# EAGLE schematic Revolve_A1 (EAGLE 7.7.0)
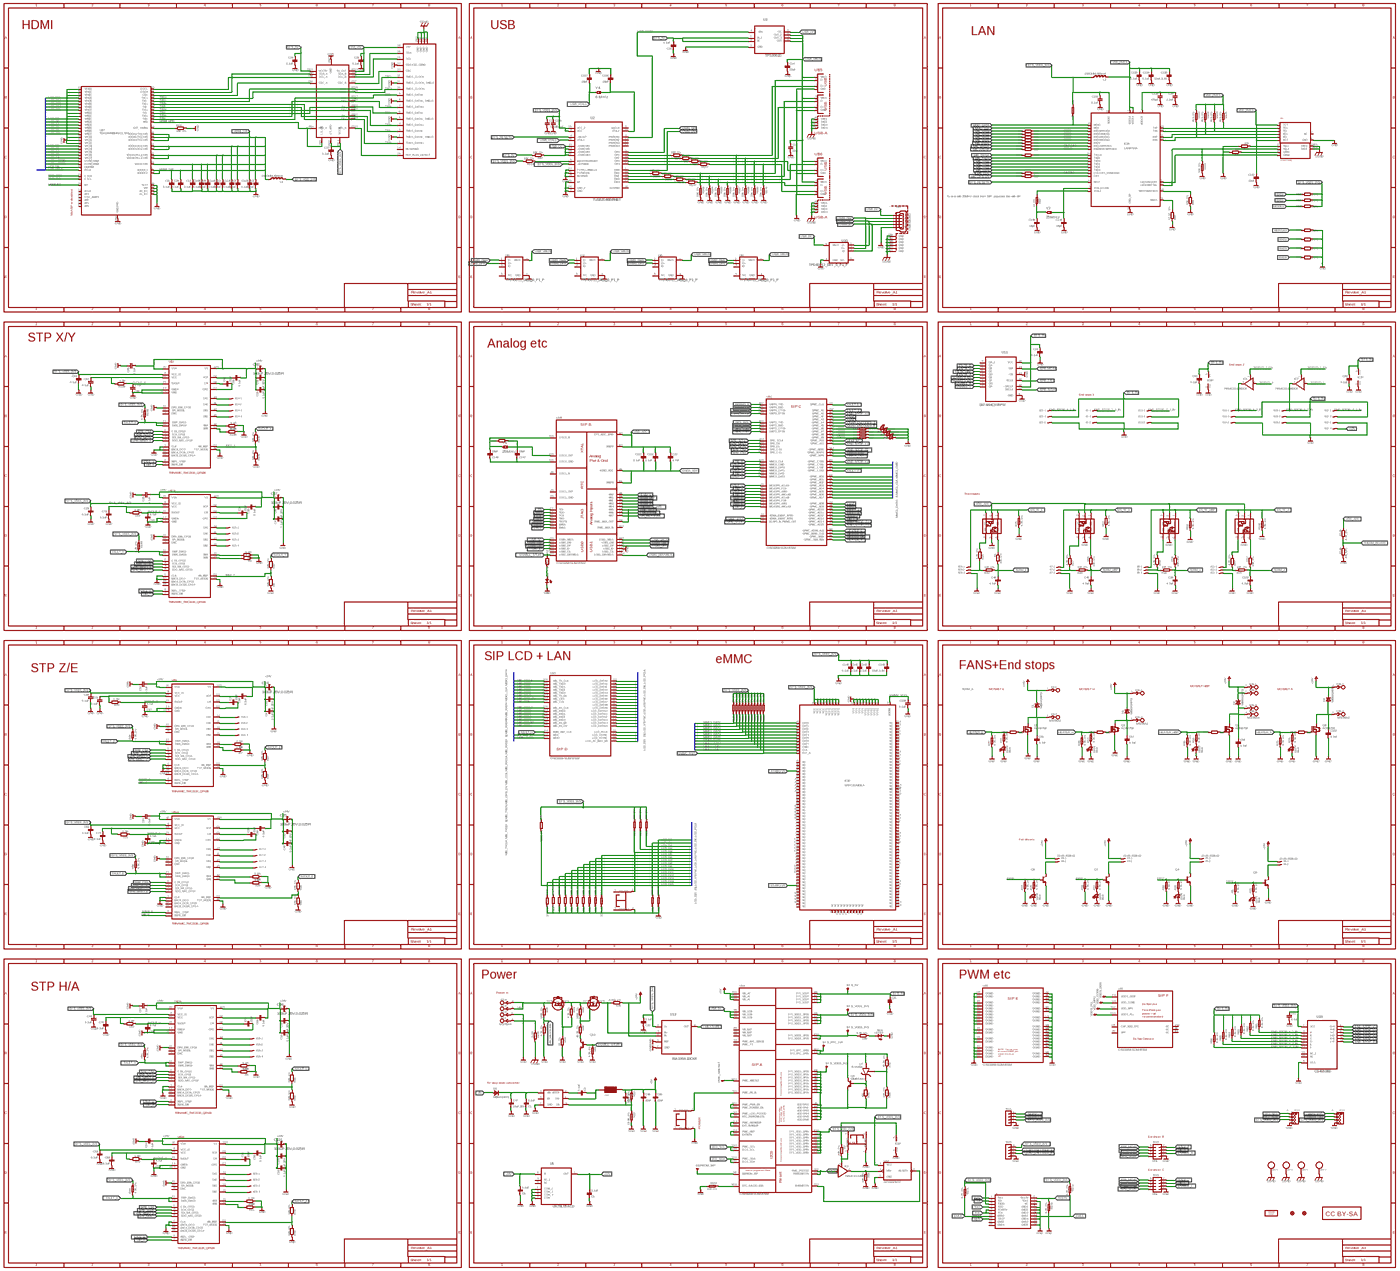
[diagram p0: schematic, sheet 1, overview]
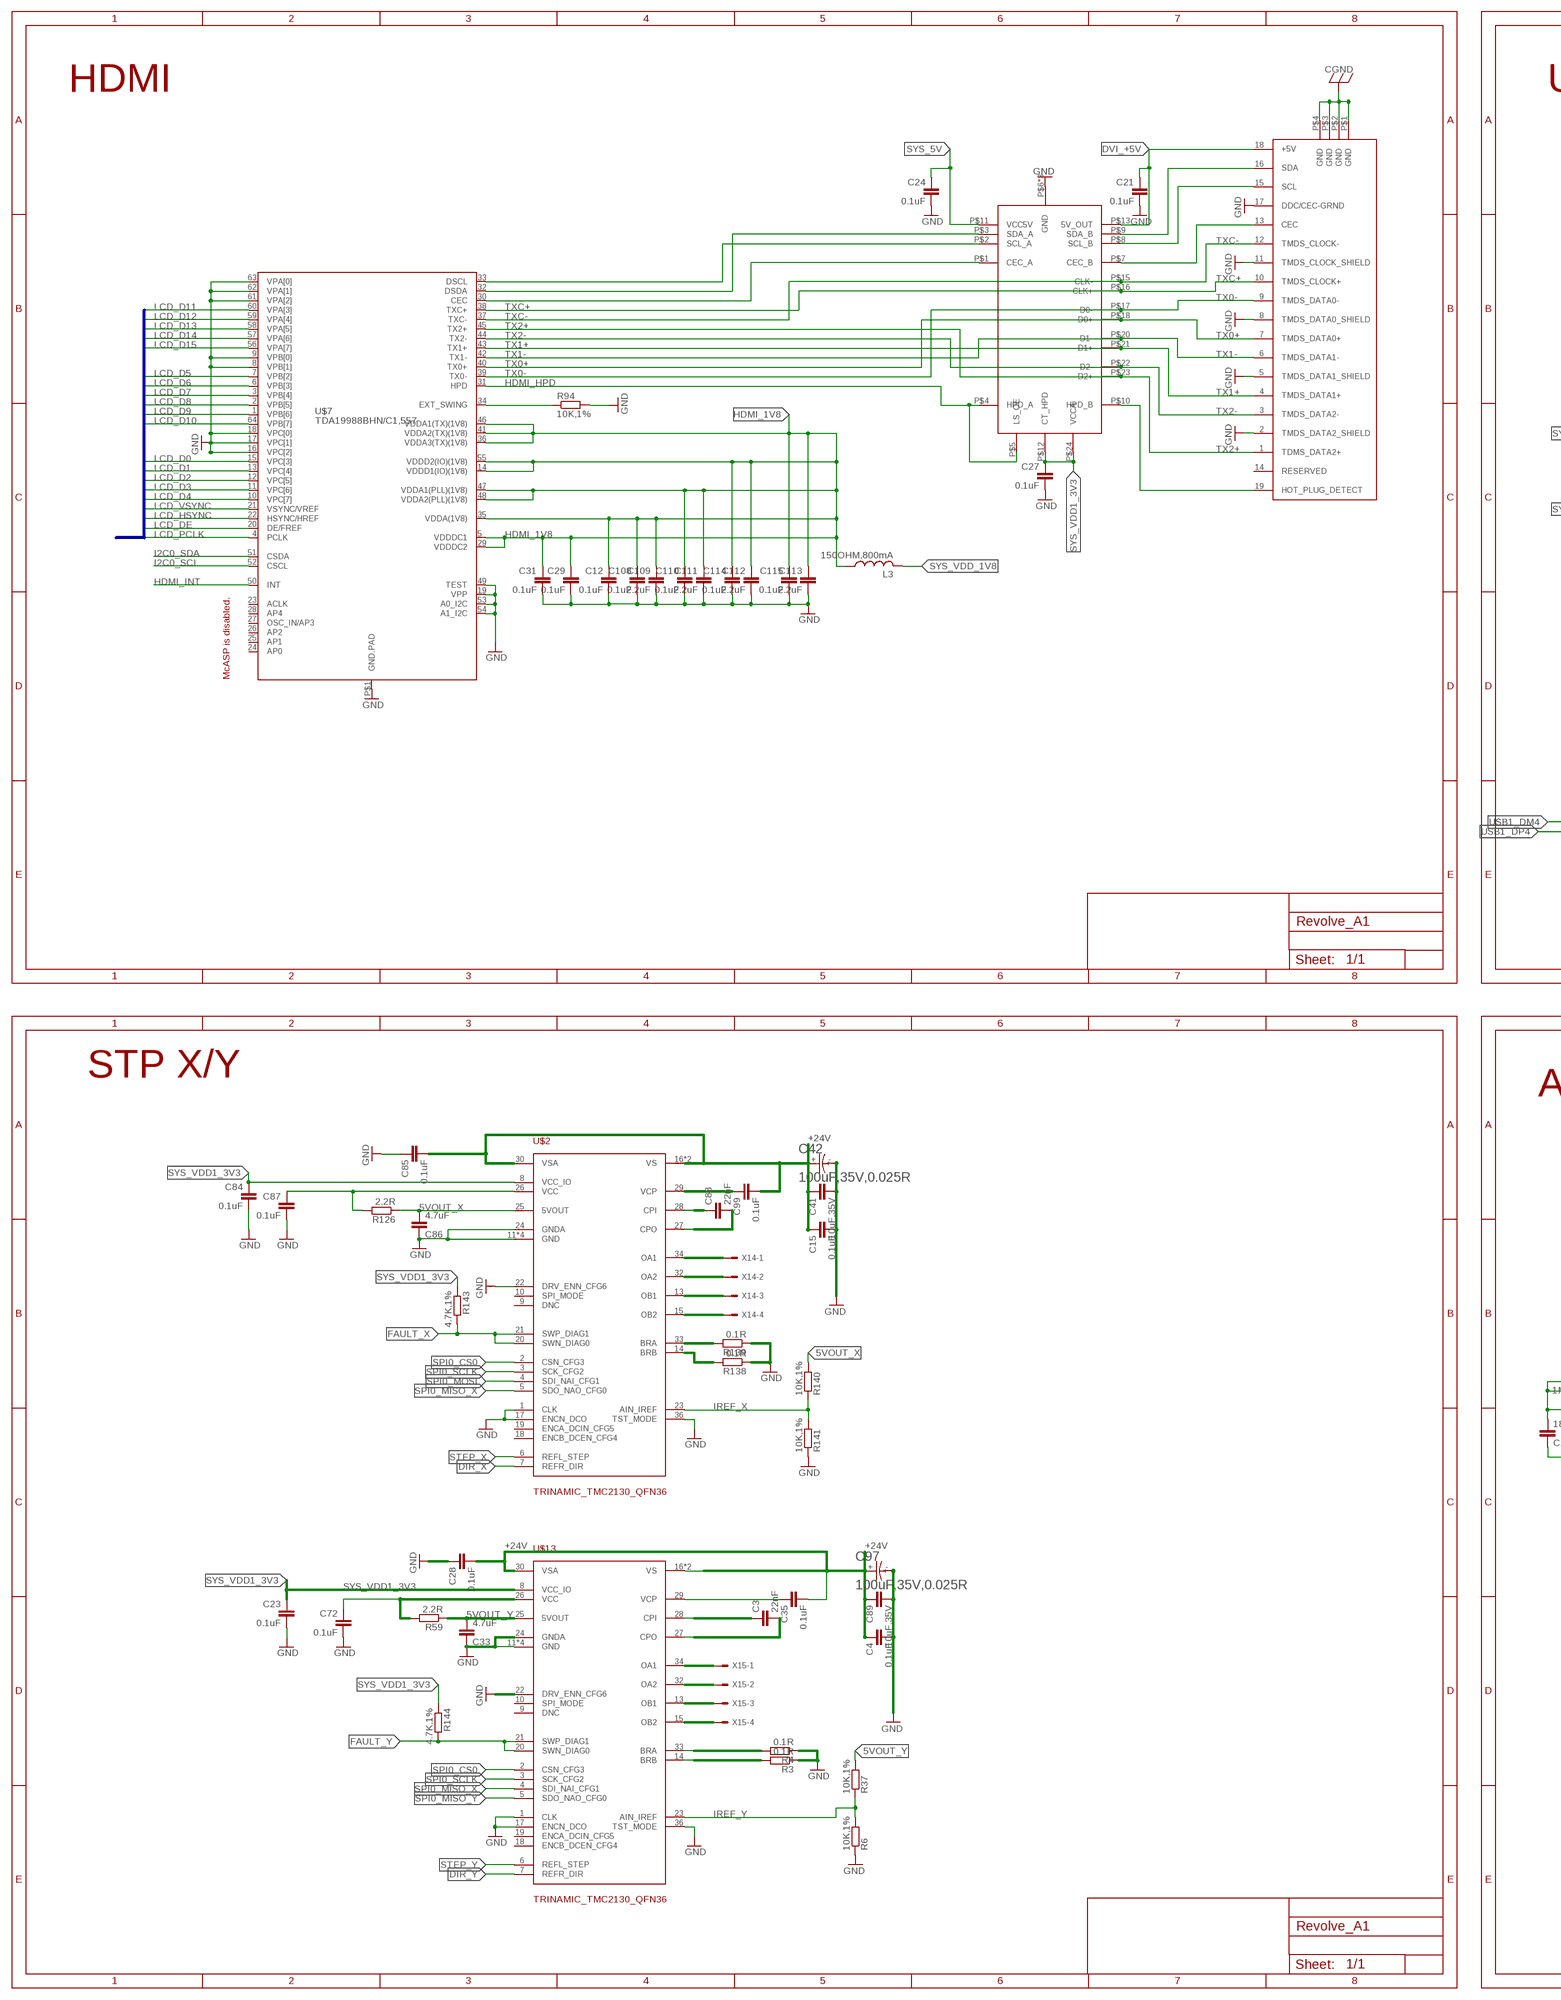
[diagram p1: schematic, sheet 1, part 1 of 6]
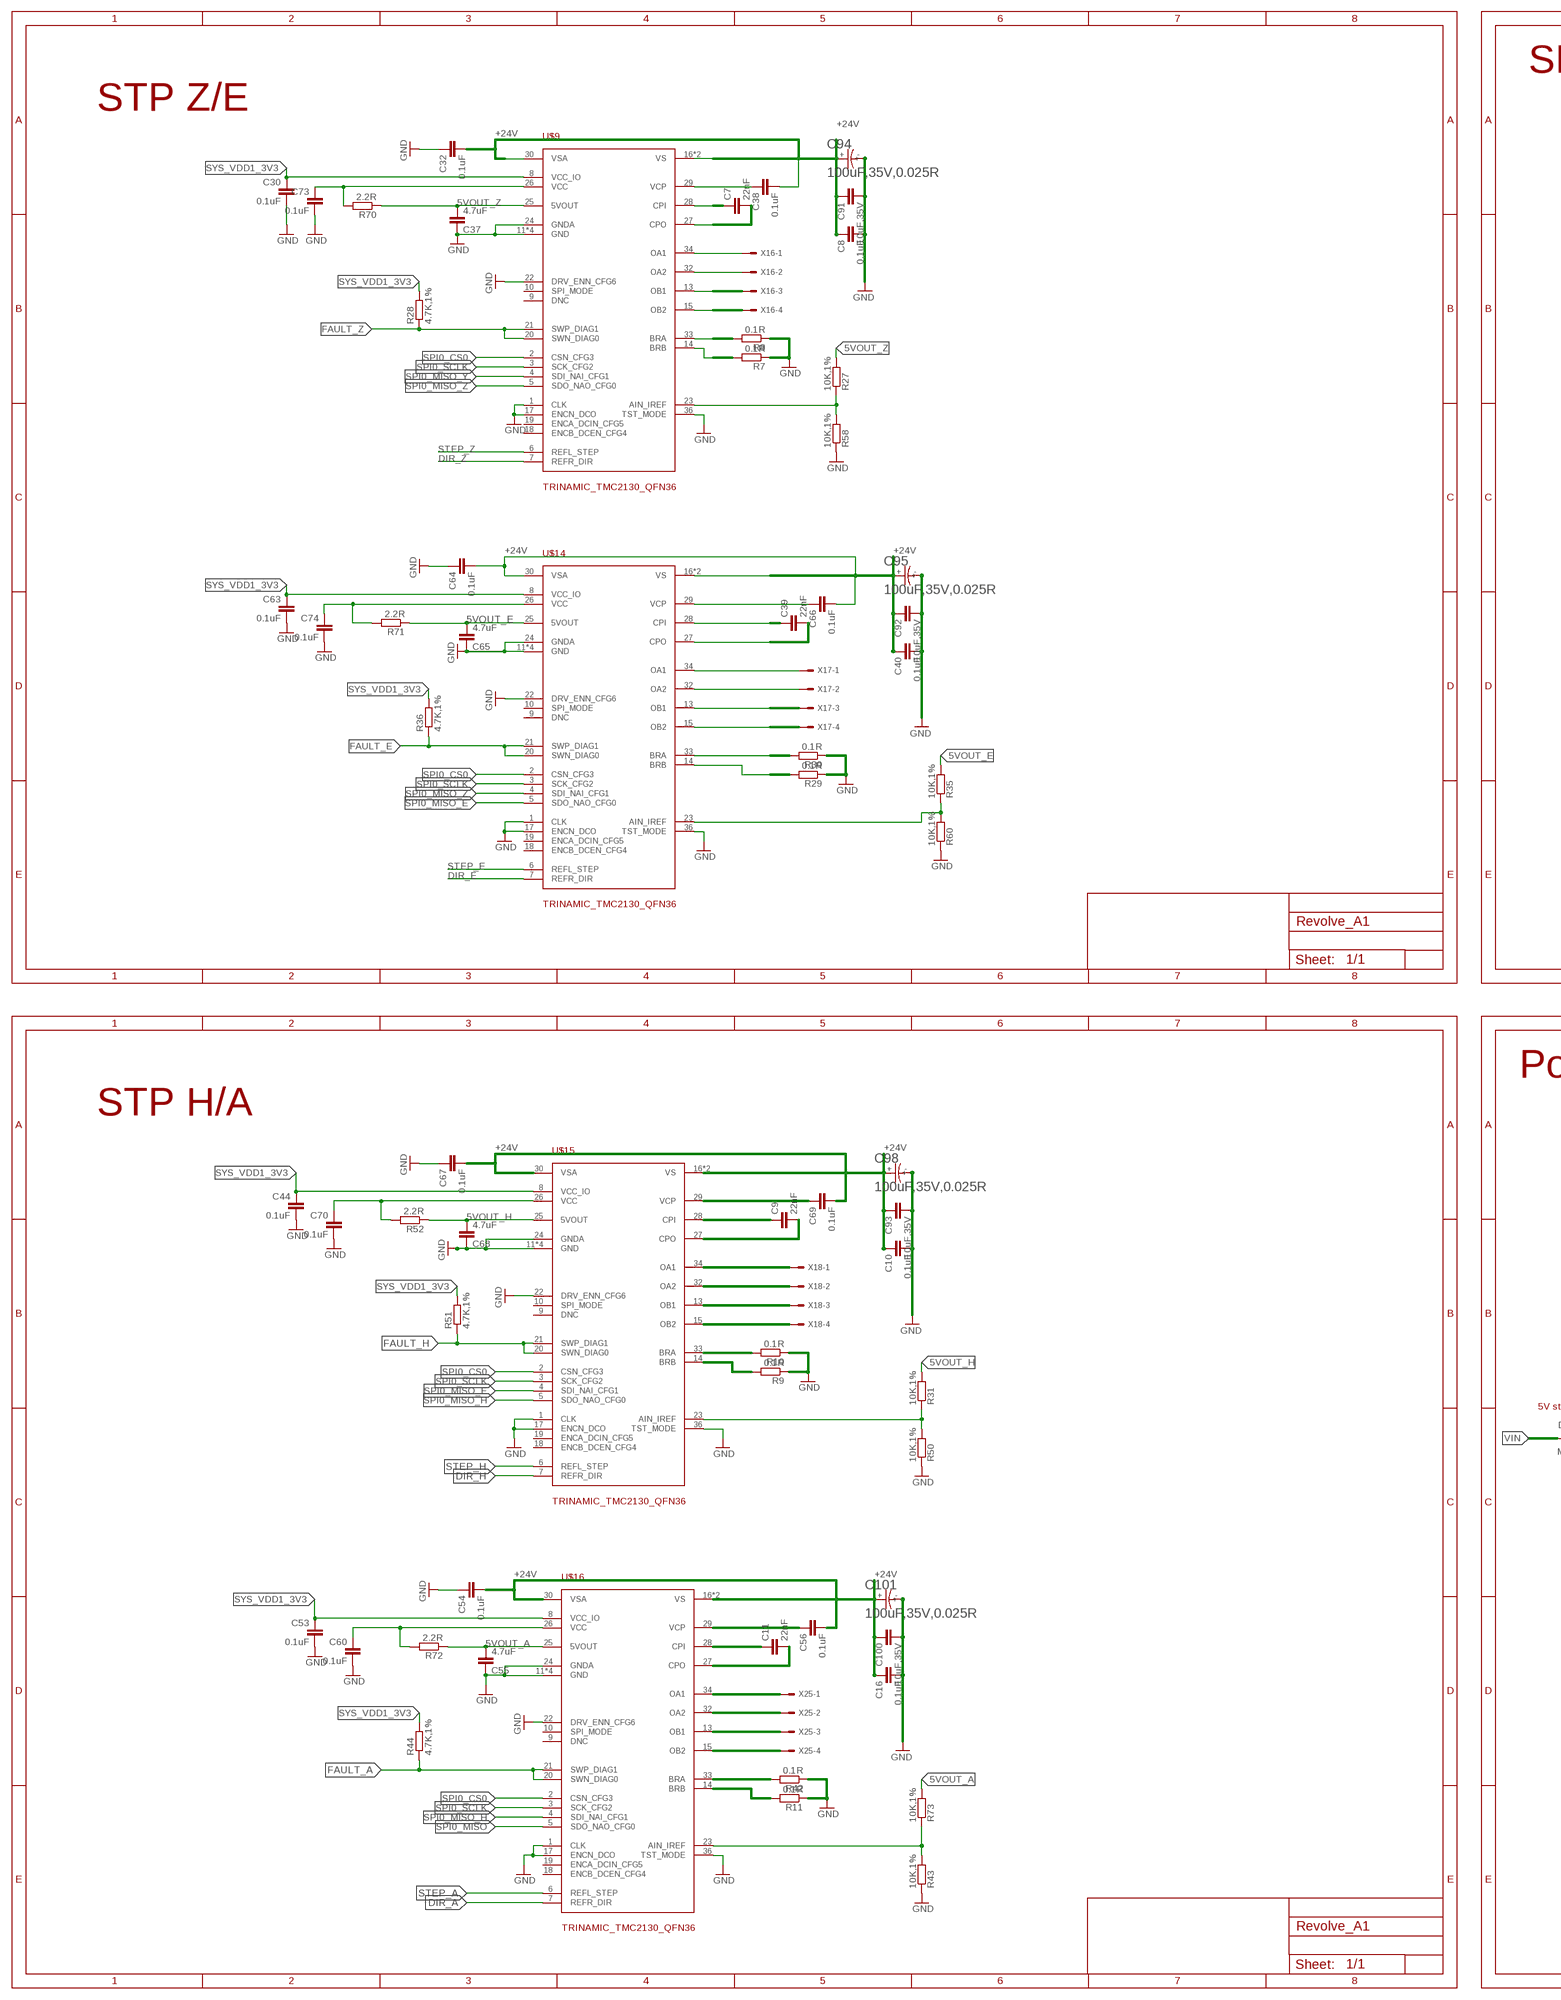
[diagram p2: schematic, sheet 1, part 2 of 6]
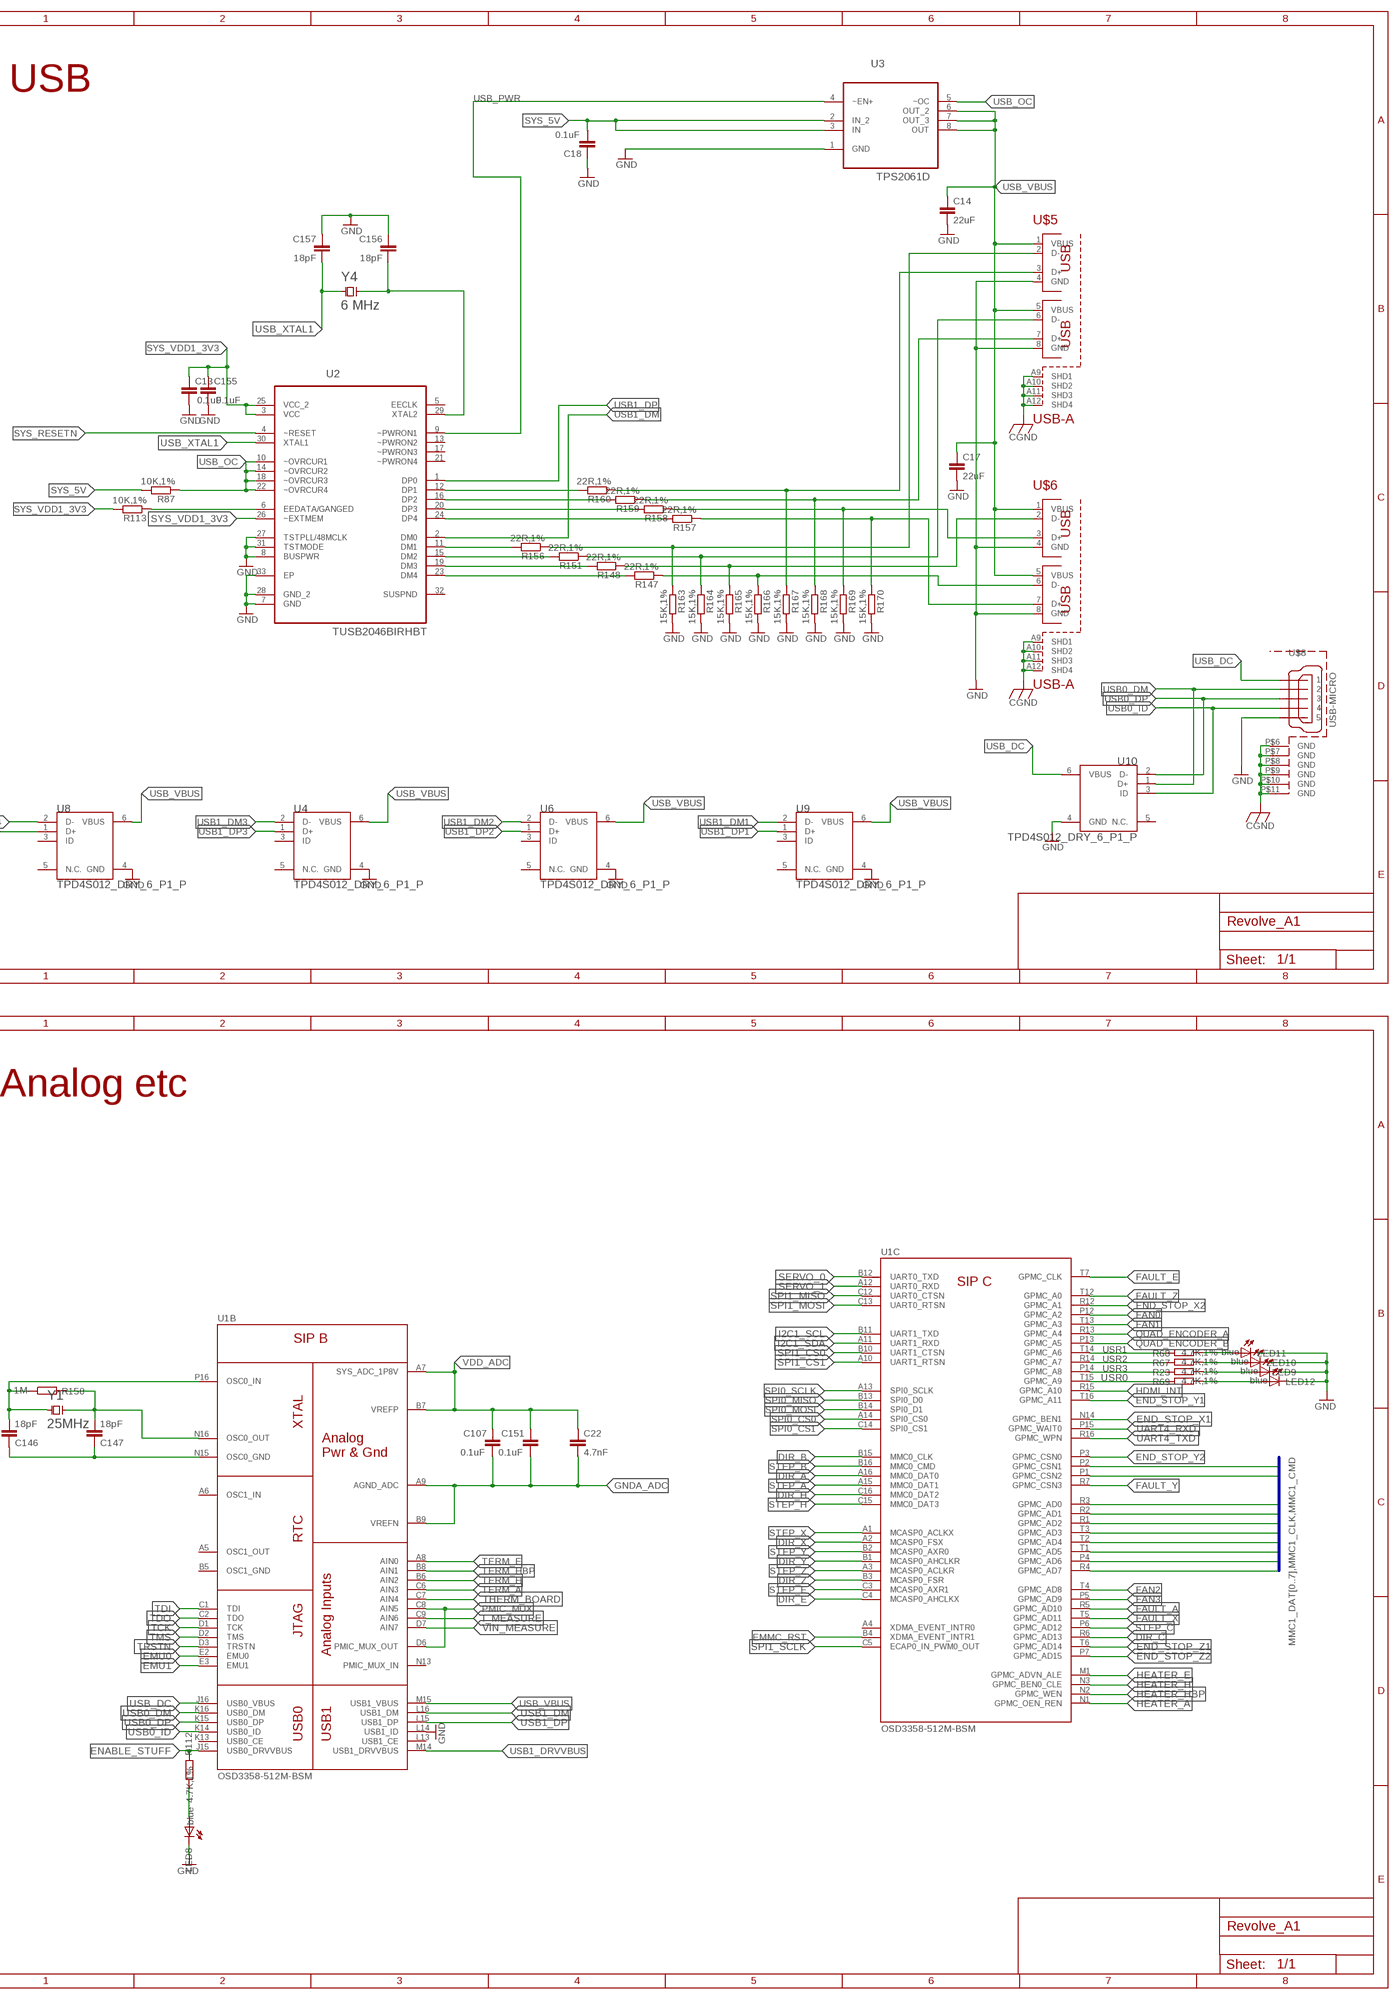
[diagram p3: schematic, sheet 1, part 3 of 6]
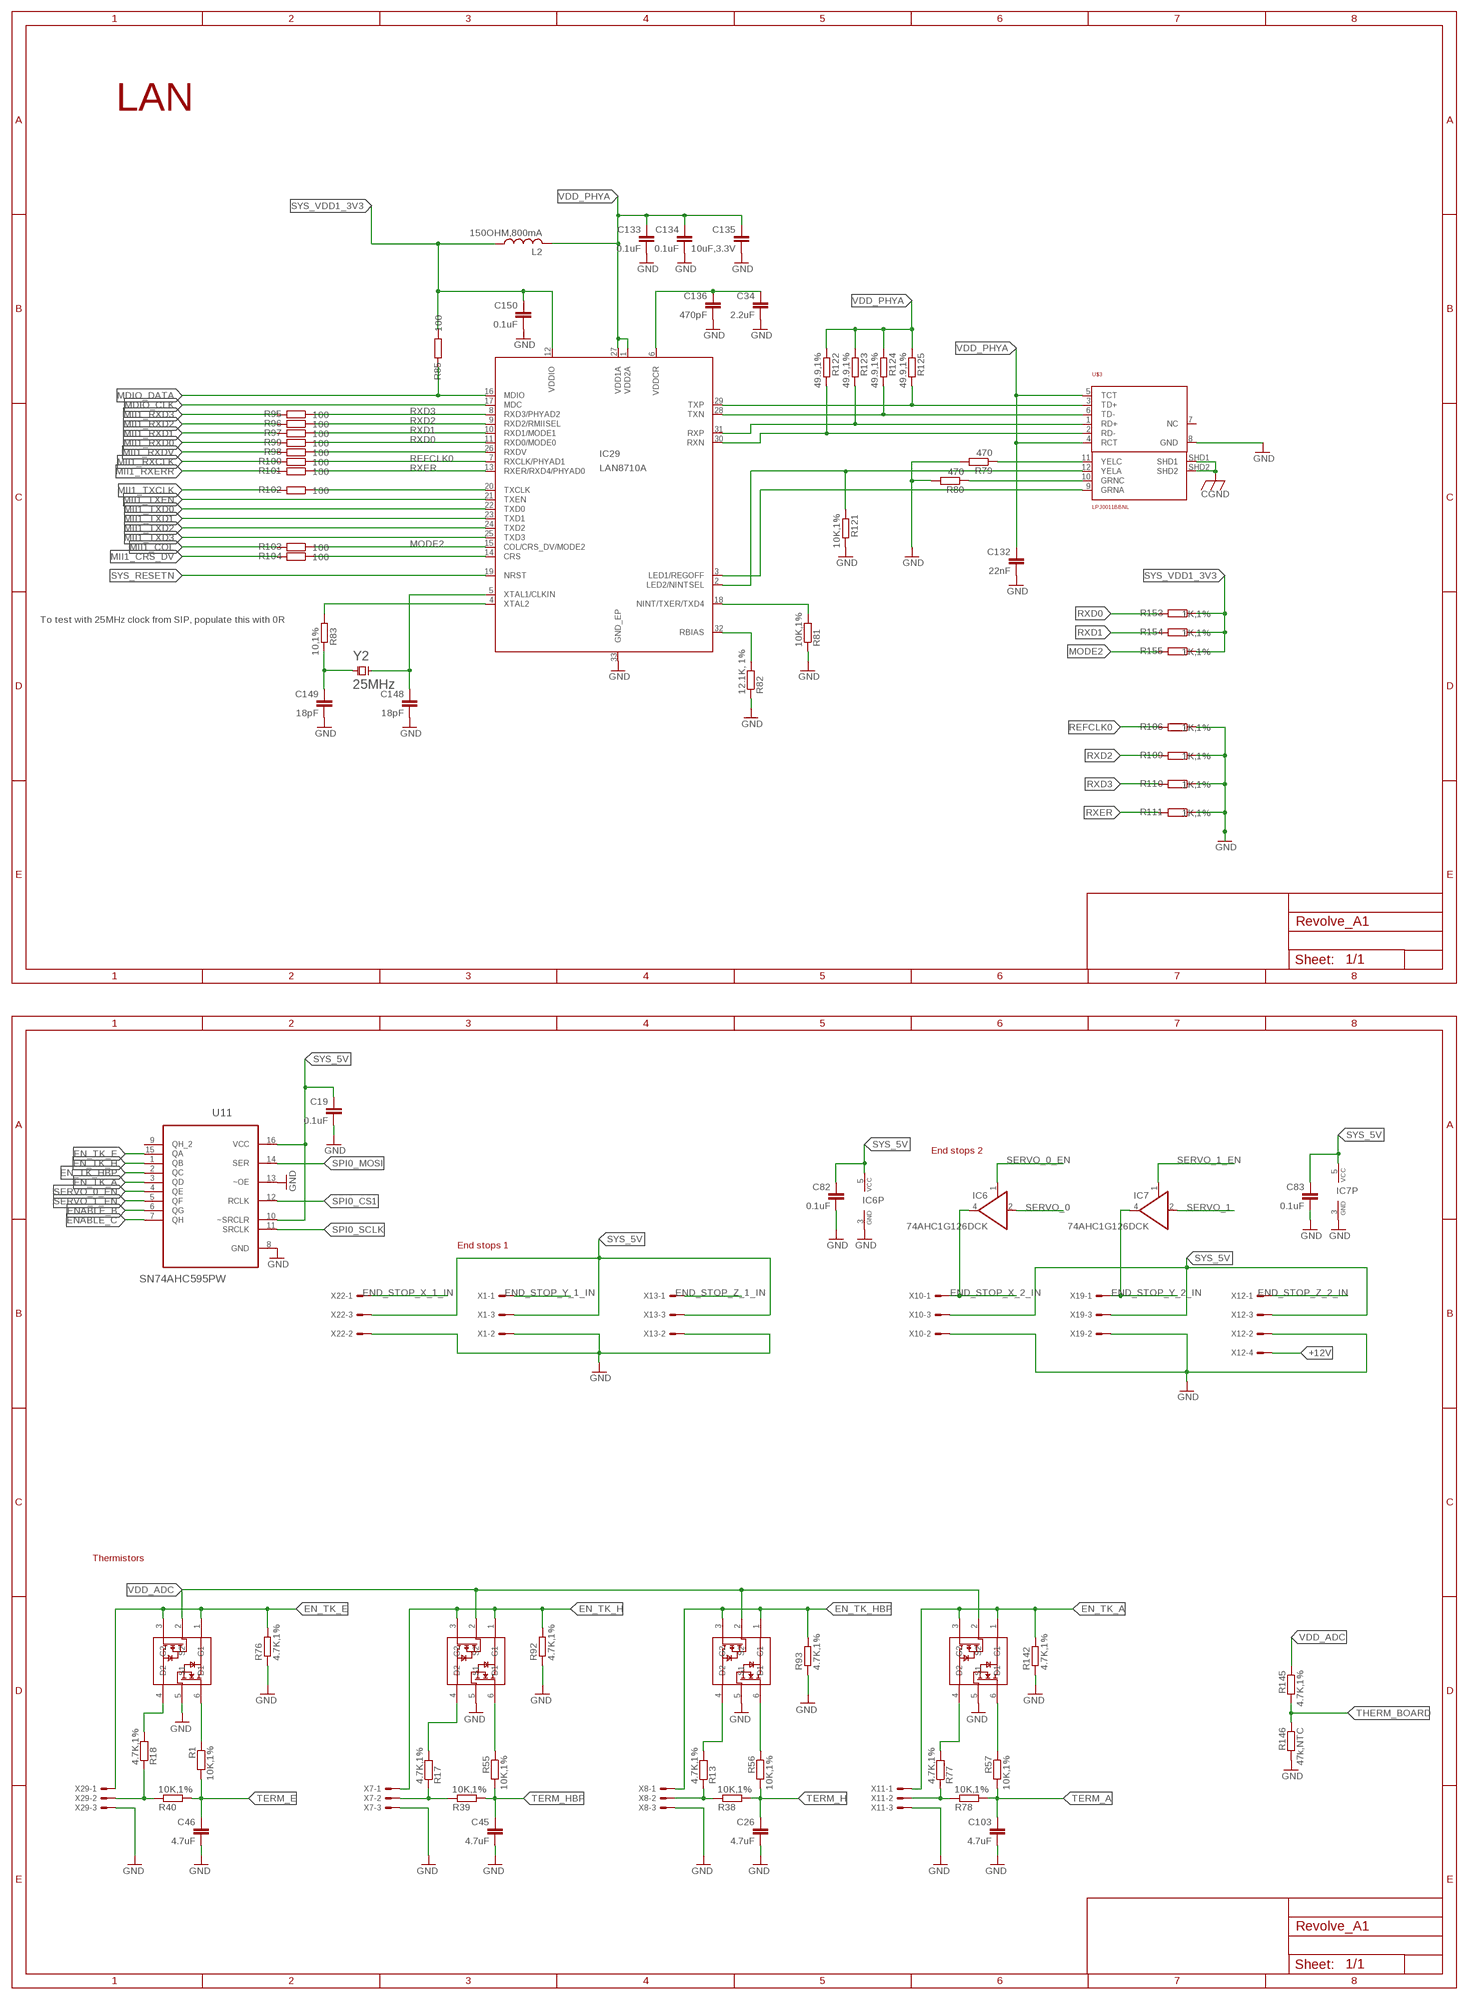
[diagram p4: schematic, sheet 1, part 4 of 6]
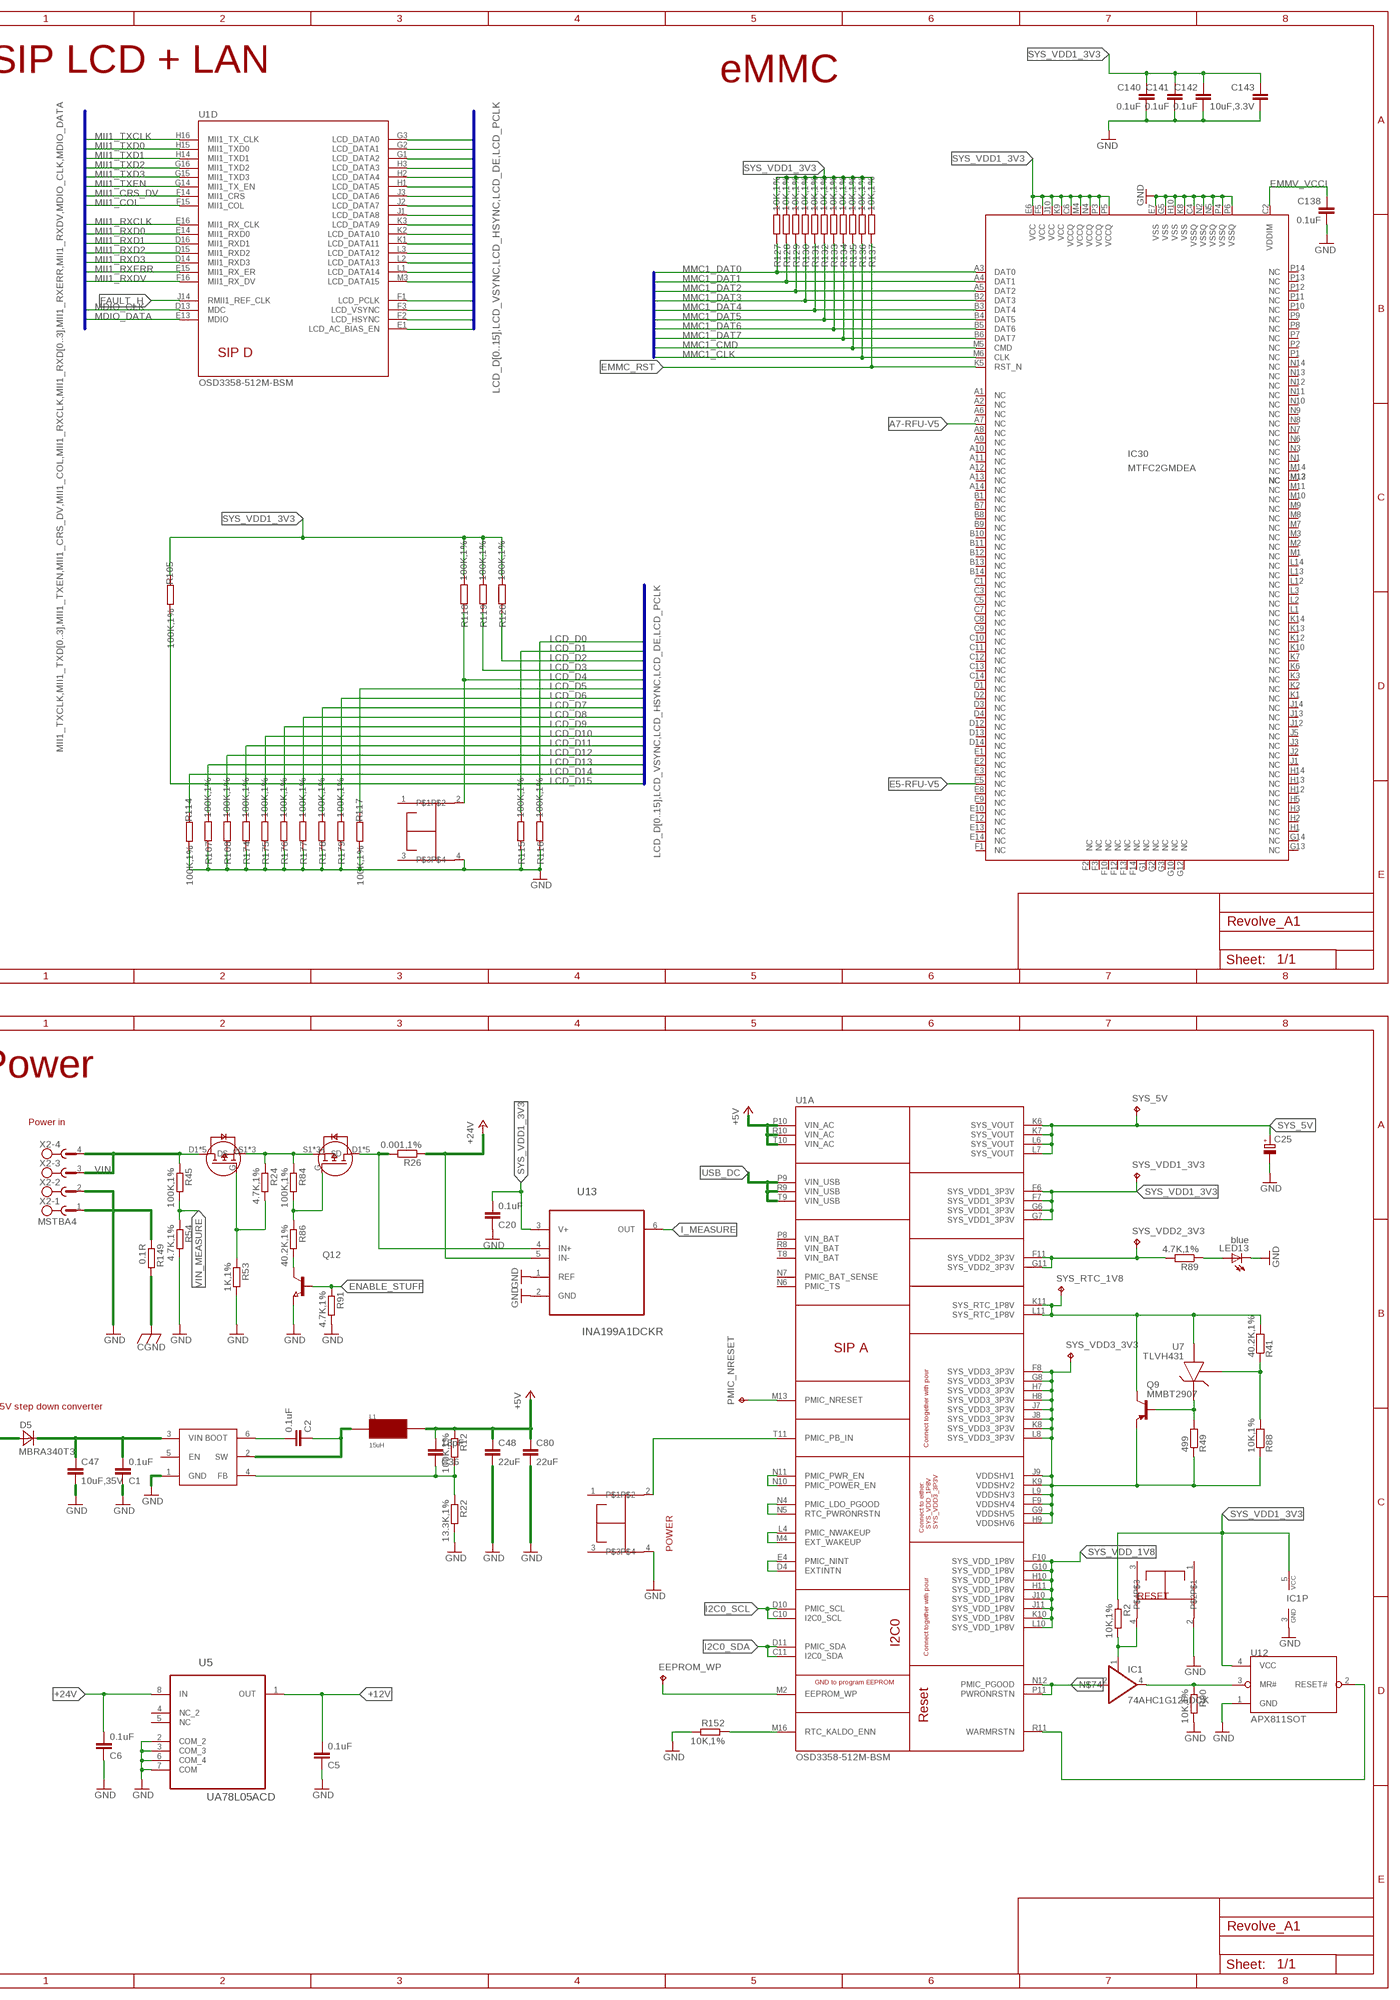
[diagram p5: schematic, sheet 1, part 5 of 6]
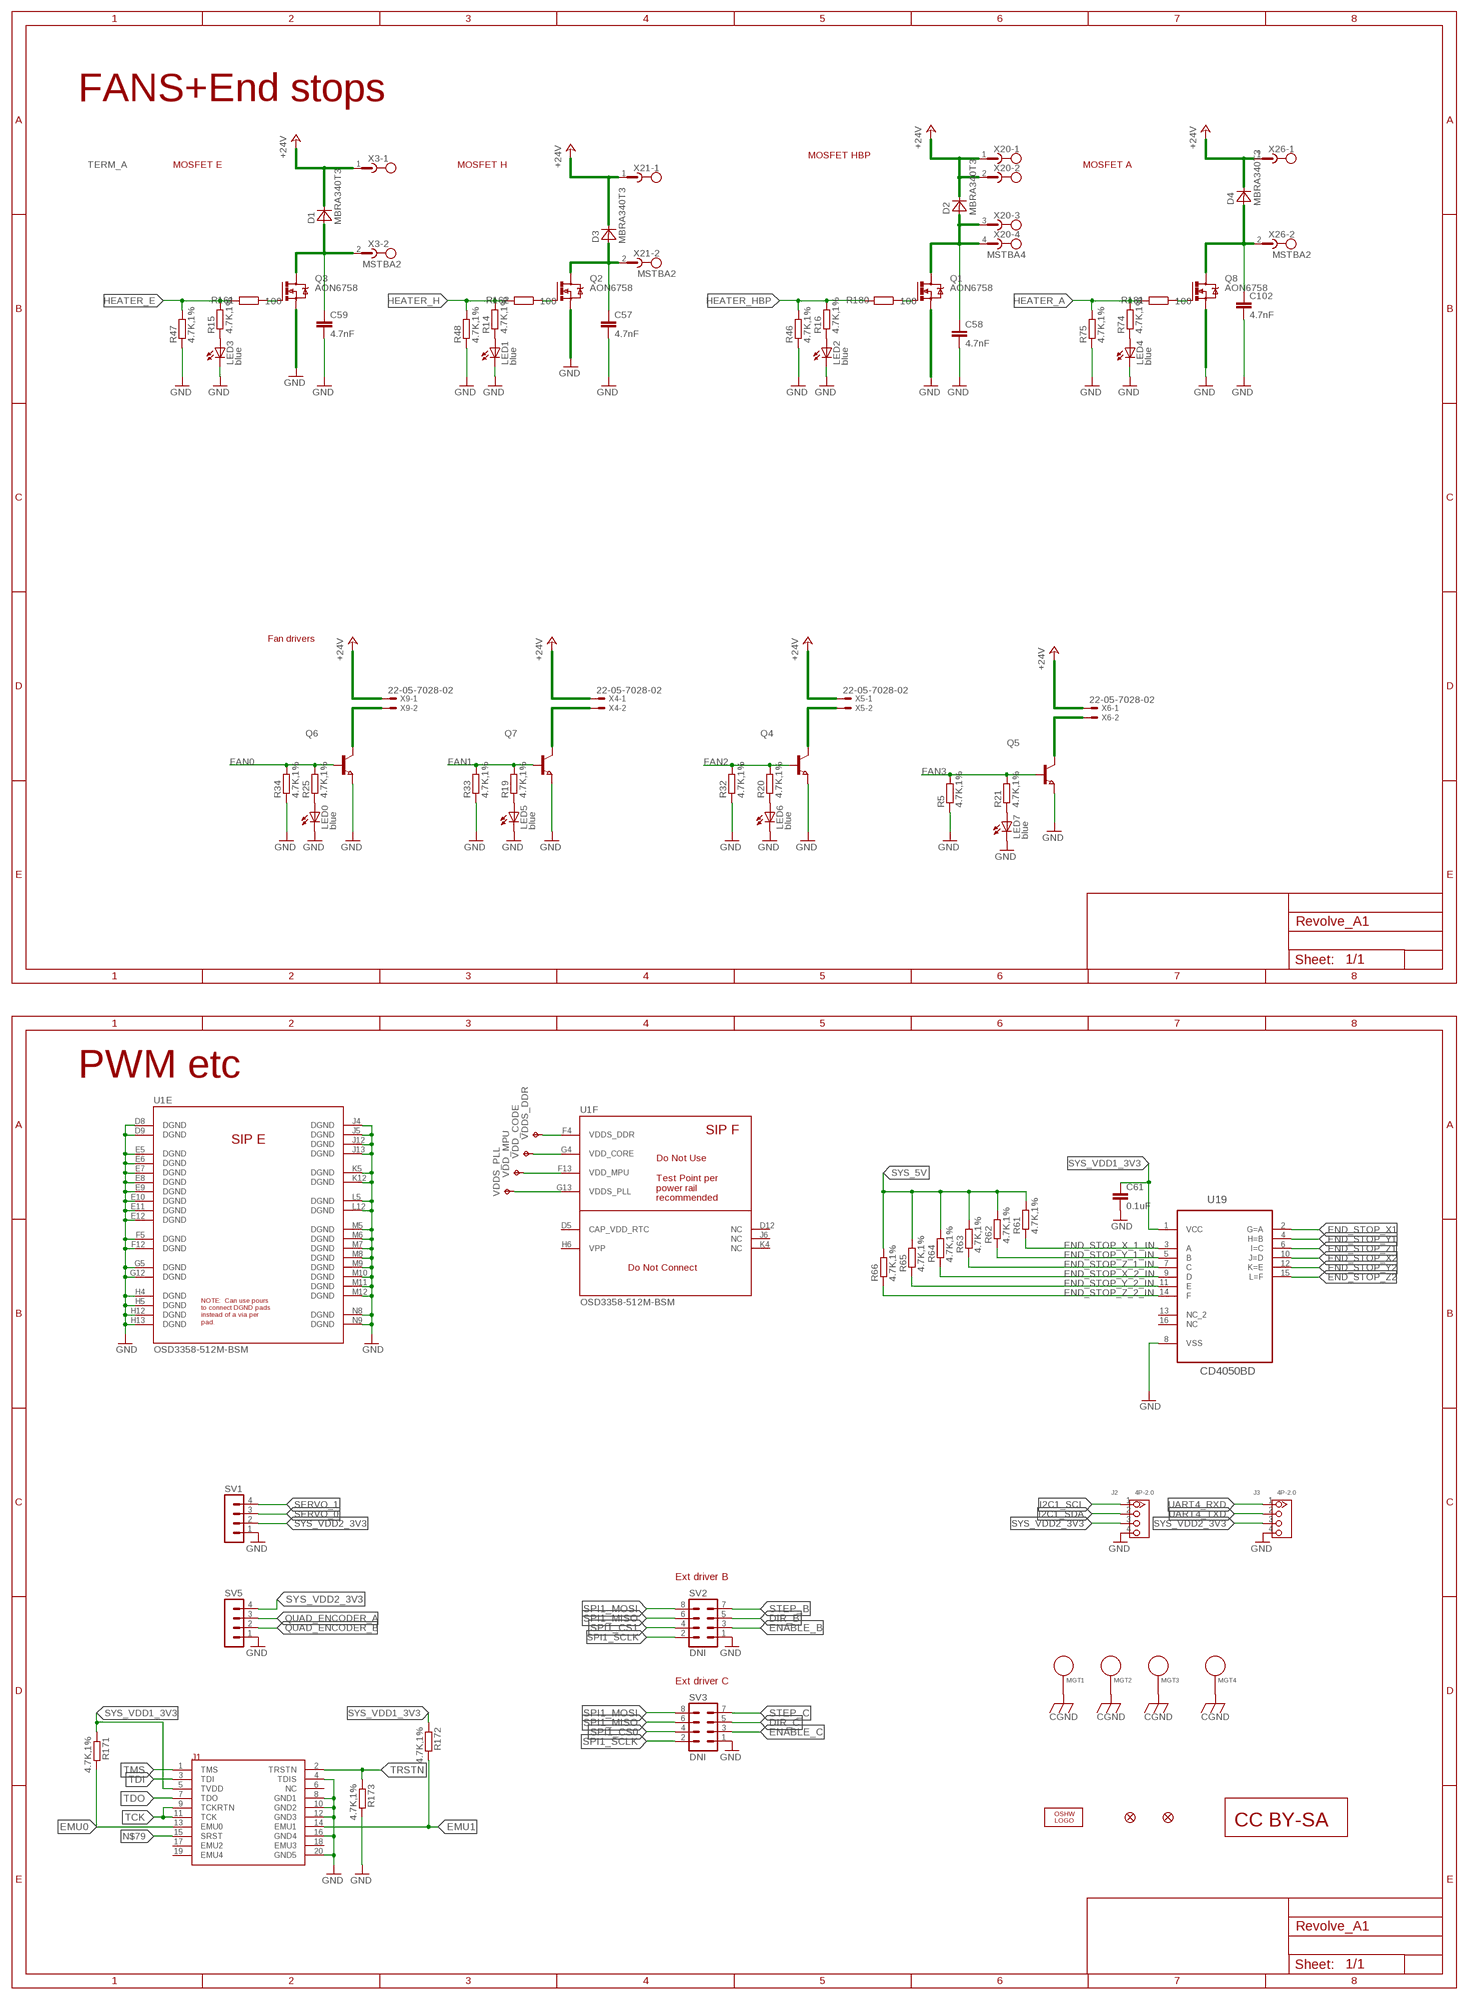
[diagram p6: schematic, sheet 1, part 6 of 6]

## Parts
C1  0.1uF  C-EUC0402  [C0402]
C2  0.1uF  C-EUC0402  [C0402]
C3  22nF  C-EUC0402  [C0402]
C4  0.1uF  C-EUC0402  [C0402]
C5  0.1uF  C-EUC0402  [C0402]
C6  0.1uF  C-EUC0402  [C0402]
C7  22nF  C-EUC0402  [C0402]
C8  0.1uF  C-EUC0402  [C0402]
C9  22nF  C-EUC0402  [C0402]
C10  0.1uF  C-EUC0402  [C0402]
C11  22nF  C-EUC0402  [C0402]
C12  0.1uF  C-EUC0402  [C0402]
C13  0.1uF  C-EUC0402  [C0402]
C14  22uF  C-EUC1206  [C1206]
C15  0.1uF  C-EUC0402  [C0402]
C16  0.1uF  C-EUC0402  [C0402]
C17  22uF  C-EUC1206  [C1206]
C18  0.1uF  C-EUC0402  [C0402]
C19  0.1uF  C-EUC0402  [C0402]
C20  0.1uF  C-EUC0402  [C0402]
C21  0.1uF  C-EUC0402  [C0402]
C22  4.7nF  C-EUC0402  [C0402]
C23  0.1uF  C-EUC0402  [C0402]
C24  0.1uF  C-EUC0402  [C0402]
C25  CPOL-EU153CLV-0605  [153CLV-0605]
C26  4.7uF  C-EUC0402  [C0402]
C27  0.1uF  C-EUC0402  [C0402]
C28  0.1uF  C-EUC0402  [C0402]
C29  0.1uF  C-EUC0402  [C0402]
C30  0.1uF  C-EUC0402  [C0402]
C31  0.1uF  C-EUC0402  [C0402]
C32  0.1uF  C-EUC0402  [C0402]
C33  4.7uF  C-EUC0402  [C0402]
C34  2.2uF  C-EUC0402  [C0402]
C35  0.1uF  C-EUC0402  [C0402]
C36  18pF  C-EUC0402  [C0402]
C37  4.7uF  C-EUC0402  [C0402]
C38  0.1uF  C-EUC0402  [C0402]
C39  22nF  C-EUC0402  [C0402]
C40  0.1uF  C-EUC0402  [C0402]
C41  10uF,35V  C-EUC0805  [C0805]
C42  100uF,35V,0.025R  C  [RHS1V10MCN1GS]
C44  0.1uF  C-EUC0402  [C0402]
C45  4.7uF  C-EUC0402  [C0402]
C46  4.7uF  C-EUC0402  [C0402]
C47  10uF,35V  C-EUC0805  [C0805]
C48  22uF  C-EUC1206  [C1206]
C53  0.1uF  C-EUC0402  [C0402]
C54  0.1uF  C-EUC0402  [C0402]
C55  4.7uF  C-EUC0402  [C0402]
C56  0.1uF  C-EUC0402  [C0402]
C57  4.7nF  C-EUC0402  [C0402]
C58  4.7nF  C-EUC0402  [C0402]
C59  4.7nF  C-EUC0402  [C0402]
C60  0.1uF  C-EUC0402  [C0402]
C61  0.1uF  C-EUC0402  [C0402]
C63  0.1uF  C-EUC0402  [C0402]
C64  0.1uF  C-EUC0402  [C0402]
C65  4.7uF  C-EUC0402  [C0402]
C66  0.1uF  C-EUC0402  [C0402]
C67  0.1uF  C-EUC0402  [C0402]
C68  4.7uF  C-EUC0402  [C0402]
C69  0.1uF  C-EUC0402  [C0402]
C70  0.1uF  C-EUC0402  [C0402]
C72  0.1uF  C-EUC0402  [C0402]
C73  0.1uF  C-EUC0402  [C0402]
C74  0.1uF  C-EUC0402  [C0402]
C80  22uF  C-EUC1206  [C1206]
C82  0.1uF  C-EUC0402  [C0402]
C83  0.1uF  C-EUC0402  [C0402]
C84  0.1uF  C-EUC0402  [C0402]
C85  0.1uF  C-EUC0402  [C0402]
C86  4.7uF  C-EUC0402  [C0402]
C87  0.1uF  C-EUC0402  [C0402]
C88  22nF  C-EUC0402  [C0402]
C89  10uF,35V  C-EUC0805  [C0805]
C91  10uF,35V  C-EUC0805  [C0805]
C92  10uF,35V  C-EUC0805  [C0805]
C93  10uF,35V  C-EUC0805  [C0805]
C94  100uF,35V,0.025R  C  [RHS1V10MCN1GS]
C95  100uF,35V,0.025R  C  [RHS1V10MCN1GS]
C97  100uF,35V,0.025R  C  [RHS1V10MCN1GS]
C98  100uF,35V,0.025R  C  [RHS1V10MCN1GS]
C99  0.1uF  C-EUC0402  [C0402]
C100  10uF,35V  C-EUC0805  [C0805]
C101  100uF,35V,0.025R  C  [RHS1V10MCN1GS]
C102  4.7nF  C-EUC0402  [C0402]
C103  4.7uF  C-EUC0402  [C0402]
C107  0.1uF  C-EUC0402  [C0402]
C108  0.1uF  C-EUC0402  [C0402]
C109  2.2uF  C-EUC0402  [C0402]
C110  0.1uF  C-EUC0402  [C0402]
C111  2.2uF  C-EUC0402  [C0402]
C112  2.2uF  C-EUC0402  [C0402]
C113  2.2uF  C-EUC0402  [C0402]
C114  0.1uF  C-EUC0402  [C0402]
C115  0.1uF  C-EUC0402  [C0402]
C132  22nF  C-EUC0402  [C0402]
C133  0.1uF  C-EUC0402  [C0402]
C134  0.1uF  C-EUC0402  [C0402]
C135  10uF,3.3V  C-EUC0805  [C0805]
C136  470pF  C-EUC0402  [C0402]
C138  0.1uF  C-EUC0402  [C0402]
C140  0.1uF  C-EUC0402  [C0402]
C141  0.1uF  C-EUC0402  [C0402]
C142  0.1uF  C-EUC0402  [C0402]
C143  10uF,3.3V  C-EUC0805  [C0805]
C146  18pF  C-EUC0402  [C0402]
C147  18pF  C-EUC0402  [C0402]
C148  18pF  C-EUC0402  [C0402]
C149  18pF  C-EUC0402  [C0402]
C150  0.1uF  C-EUC0402  [C0402]
C151  0.1uF  C-EUC0402  [C0402]
C155  0.1uF  C-EUC0402  [C0402]
C156  18pF  C-EUC0402  [C0402]
C157  18pF  C-EUC0402  [C0402]
D1  MBRA340T3  [SMA]
D2  MBRA340T3  [SMA]
D3  MBRA340T3  [SMA]
D4  MBRA340T3  [SMA]
D5  MBRA340T3  [SMA]
EEPROM_WP  TPB1,27  [B1,27]
IC1  74AHC1G126DCK  [SC70-5]
IC6  74AHC1G126DCK  [SC70-5]
IC7  74AHC1G126DCK  [SC70-5]
IC29  LAN8710A  [32-QFN]
IC30  MTFC2GMDEA  [WFBGA]
J1  CTI-JTAG  [CTI-JTAG]
J2  4P-2.0  GROVE-CONNECTOR-DIP(4P-2.0)  [HW4-2.0]
J3  4P-2.0  GROVE-CONNECTOR-DIP(4P-2.0)  [HW4-2.0]
JP1  FIDUCIAL1X2.5  [FIDUCIAL-1X2.5]
JP2  FIDUCIAL1X2.5  [FIDUCIAL-1X2.5]
L1  15uH  RT8040T330  [NR8040T330]
L2  150OHM,800mA  L-USL2012C  [L2012C]
L3  150OHM,800mA  L-USL2012C  [L2012C]
LED0  blue  LEDCHIP-LED0603  [CHIP-LED0603]
LED1  blue  LEDCHIP-LED0603  [CHIP-LED0603]
LED2  blue  LEDCHIP-LED0603  [CHIP-LED0603]
LED3  blue  LEDCHIP-LED0603  [CHIP-LED0603]
LED4  blue  LEDCHIP-LED0603  [CHIP-LED0603]
LED5  blue  LEDCHIP-LED0603  [CHIP-LED0603]
LED6  blue  LEDCHIP-LED0603  [CHIP-LED0603]
LED7  blue  LEDCHIP-LED0603  [CHIP-LED0603]
LED8  blue  LEDCHIP-LED0603  [CHIP-LED0603]
LED9  blue  LEDCHIP-LED0603  [CHIP-LED0603]
LED10  blue  LEDCHIP-LED0603  [CHIP-LED0603]
LED11  blue  LEDCHIP-LED0603  [CHIP-LED0603]
LED12  blue  LEDCHIP-LED0603  [CHIP-LED0603]
LED13  blue  LEDCHIP-LED0603  [CHIP-LED0603]
LOGO1  OSHW_LOGO_FILLX0200-NT  [OSHW_FILLX200_NOTEXT]
MGT1  MOUNTING_HOLE  [MOUNTING_HOLE]
MGT2  MOUNTING_HOLE  [MOUNTING_HOLE]
MGT3  MOUNTING_HOLE  [MOUNTING_HOLE]
MGT4  MOUNTING_HOLE  [MOUNTING_HOLE]
PMIC_NRESET  TPTP10R  [TP10R]
Q1  AON6758  [8-DFN-EP-(5X6)]
Q2  AON6758  [8-DFN-EP-(5X6)]
Q3  AON6758  [8-DFN-EP-(5X6)]
Q4  NPN-TRANSISTOR_SOT23  [SOT23]
Q5  NPN-TRANSISTOR_SOT23  [SOT23]
Q6  NPN-TRANSISTOR_SOT23  [SOT23]
Q7  NPN-TRANSISTOR_SOT23  [SOT23]
Q8  AON6758  [8-DFN-EP-(5X6)]
Q9  MMBT2907  MMBT2907SMD  [SOT23-BEC]
Q10  DMC2038LVT  [TSOT26]
Q11  DMC2038LVT  [TSOT26]
Q12  NPN-TRANSISTOR_SOT23  [SOT23]
Q13  DMC2038LVT  [TSOT26]
Q14  DMC2038LVT  [TSOT26]
R1  10K,1%  R-EU_R0402  [R0402]
R2  10K,1%  R-EU_R0402  [R0402]
R3  0.1R  R-EU_R0805  [R0805]
R4  0.1R  R-EU_R0805  [R0805]
R5  4.7K,1%  R-EU_R0402  [R0402]
R6  10K,1%  R-EU_R0402  [R0402]
R7  0.1R  R-EU_R0805  [R0805]
R8  0.1R  R-EU_R0805  [R0805]
R9  0.1R  R-EU_R0805  [R0805]
R10  0.1R  R-EU_R0805  [R0805]
R11  0.1R  R-EU_R0805  [R0805]
R12  100K,1%  R-EU_R0402  [R0402]
R13  4.7K,1%  R-EU_R0402  [R0402]
R14  4.7K,1%  R-EU_R0402  [R0402]
R15  4.7K,1%  R-EU_R0402  [R0402]
R16  4.7K,1%  R-EU_R0402  [R0402]
R17  4.7K,1%  R-EU_R0402  [R0402]
R18  4.7K,1%  R-EU_R0402  [R0402]
R19  4.7K,1%  R-EU_R0402  [R0402]
R20  4.7K,1%  R-EU_R0402  [R0402]
R21  4.7K,1%  R-EU_R0402  [R0402]
R22  13.3K,1%  R-EU_R0402  [R0402]
R23  4.7K,1%  R-EU_R0402  [R0402]
R24  4.7K,1%  R-EU_R0402  [R0402]
R25  4.7K,1%  R-EU_R0402  [R0402]
R26  0.001,1%  R-EU_R1206  [R1206]
R27  10K,1%  R-EU_R0402  [R0402]
R28  4.7K,1%  R-EU_R0402  [R0402]
R29  0.1R  R-EU_R0805  [R0805]
R30  0.1R  R-EU_R0805  [R0805]
R31  10K,1%  R-EU_R0402  [R0402]
R32  4.7K,1%  R-EU_R0402  [R0402]
R33  4.7K,1%  R-EU_R0402  [R0402]
R34  4.7K,1%  R-EU_R0402  [R0402]
R35  10K,1%  R-EU_R0402  [R0402]
R36  4.7K,1%  R-EU_R0402  [R0402]
R37  10K,1%  R-EU_R0402  [R0402]
R38  10K,1%  R-EU_R0402  [R0402]
R39  10K,1%  R-EU_R0402  [R0402]
R40  10K,1%  R-EU_R0402  [R0402]
R41  40.2K,1%  R-EU_R0402  [R0402]
R42  0.1R  R-EU_R0805  [R0805]
R43  10K,1%  R-EU_R0402  [R0402]
R44  4.7K,1%  R-EU_R0402  [R0402]
R45  100K,1%  R-EU_R0402  [R0402]
R46  4.7K,1%  R-EU_R0402  [R0402]
R47  4.7K,1%  R-EU_R0402  [R0402]
R48  4.7K,1%  R-EU_R0402  [R0402]
R49  499  R-EU_R0402  [R0402]
R50  10K,1%  R-EU_R0402  [R0402]
R51  4.7K,1%  R-EU_R0402  [R0402]
R52  2.2R  R-EU_R0402  [R0402]
R53  1K,1%  R-EU_R0402  [R0402]
R54  4.7K,1%  R-EU_R0402  [R0402]
R55  10K,1%  R-EU_R0402  [R0402]
R56  10K,1%  R-EU_R0402  [R0402]
R57  10K,1%  R-EU_R0402  [R0402]
R58  10K,1%  R-EU_R0402  [R0402]
R59  2.2R  R-EU_R0402  [R0402]
R60  10K,1%  R-EU_R0402  [R0402]
R61  4.7K,1%  R-EU_R0402  [R0402]
R62  4.7K,1%  R-EU_R0402  [R0402]
R63  4.7K,1%  R-EU_R0402  [R0402]
R64  4.7K,1%  R-EU_R0402  [R0402]
R65  4.7K,1%  R-EU_R0402  [R0402]
R66  4.7K,1%  R-EU_R0402  [R0402]
R67  4.7K,1%  R-EU_R0402  [R0402]
R68  4.7K,1%  R-EU_R0402  [R0402]
R69  4.7K,1%  R-EU_R0402  [R0402]
R70  2.2R  R-EU_R0402  [R0402]
R71  2.2R  R-EU_R0402  [R0402]
R72  2.2R  R-EU_R0402  [R0402]
R73  10K,1%  R-EU_R0402  [R0402]
R74  4.7K,1%  R-EU_R0402  [R0402]
R75  4.7K,1%  R-EU_R0402  [R0402]
R76  4.7K,1%  R-EU_R0402  [R0402]
R77  4.7K,1%  R-EU_R0402  [R0402]
R78  10K,1%  R-EU_R0402  [R0402]
R79  470  R-EU_R0402  [R0402]
R80  470  R-EU_R0402  [R0402]
R81  10K,1%  R-EU_R0402  [R0402]
R82  12.1K, 1%  R-EU_R0402  [R0402]
R83  10,1%  R-EU_R0402  [R0402]
R84  100K,1%  R-EU_R0402  [R0402]
R85  100  R-EU_R0402  [R0402]
R86  40.2K,1%  R-EU_R0402  [R0402]
R87  10K,1%  R-EU_R0402  [R0402]
R88  10K,1%  R-EU_R0402  [R0402]
R89  4.7K,1%  R-EU_R0402  [R0402]
R90  10K,1%  R-EU_R0402  [R0402]
R91  4.7K,1%  R-EU_R0402  [R0402]
R92  4.7K,1%  R-EU_R0402  [R0402]
R93  4.7K,1%  R-EU_R0402  [R0402]
R94  10K,1%  R-EU_R0402  [R0402]
R95  100  R-EU_R0402  [R0402]
R96  100  R-EU_R0402  [R0402]
R97  100  R-EU_R0402  [R0402]
R98  100  R-EU_R0402  [R0402]
R99  100  R-EU_R0402  [R0402]
R100  100  R-EU_R0402  [R0402]
R101  100  R-EU_R0402  [R0402]
R102  100  R-EU_R0402  [R0402]
R103  100  R-EU_R0402  [R0402]
R104  100  R-EU_R0402  [R0402]
R105  100K,1%  R-EU_R0402  [R0402]
R106  1K,1%  R-EU_R0402  [R0402]
R107  100K,1%  R-EU_R0402  [R0402]
R108  100K,1%  R-EU_R0402  [R0402]
R109  1K,1%  R-EU_R0402  [R0402]
R110  1K,1%  R-EU_R0402  [R0402]
R111  1K,1%  R-EU_R0402  [R0402]
R112  4.7K,1%  R-EU_R0402  [R0402]
R113  10K,1%  R-EU_R0402  [R0402]
R114  100K,1%  R-EU_R0402  [R0402]
R115  100K,1%  R-EU_R0402  [R0402]
R116  100K,1%  R-EU_R0402  [R0402]
R117  100K,1%  R-EU_R0402  [R0402]
R118  100K,1%  R-EU_R0402  [R0402]
R119  100K,1%  R-EU_R0402  [R0402]
R120  100K,1%  R-EU_R0402  [R0402]
R121  10K,1%  R-EU_R0402  [R0402]
R122  49.9,1%  R-EU_R0402  [R0402]
R123  49.9,1%  R-EU_R0402  [R0402]
R124  49.9,1%  R-EU_R0402  [R0402]
R125  49.9,1%  R-EU_R0402  [R0402]
R126  2.2R  R-EU_R0402  [R0402]
R127  10K,1%  R-EU_R0402  [R0402]
R128  10K,1%  R-EU_R0402  [R0402]
R129  10K,1%  R-EU_R0402  [R0402]
R130  10K,1%  R-EU_R0402  [R0402]
R131  10K,1%  R-EU_R0402  [R0402]
R132  10K,1%  R-EU_R0402  [R0402]
R133  10K,1%  R-EU_R0402  [R0402]
R134  10K,1%  R-EU_R0402  [R0402]
R135  10K,1%  R-EU_R0402  [R0402]
R136  10K,1%  R-EU_R0402  [R0402]
R137  10K,1%  R-EU_R0402  [R0402]
R138  0.1R  R-EU_R0805  [R0805]
R139  0.1R  R-EU_R0805  [R0805]
R140  10K,1%  R-EU_R0402  [R0402]
R141  10K,1%  R-EU_R0402  [R0402]
R142  4.7K,1%  R-EU_R0402  [R0402]
R143  4.7K,1%  R-EU_R0402  [R0402]
R144  4.7K,1%  R-EU_R0402  [R0402]
R145  4.7K,1%  R-EU_R0402  [R0402]
R146  47k,NTC  R-EU_R0402  [R0402]
R147  22R,1%  R-EU_R0402  [R0402]
R148  22R,1%  R-EU_R0402  [R0402]
R149  0.1R  R-EU_R0805  [R0805]
R150  1M  R-EU_R0402  [R0402]
R151  22R,1%  R-EU_R0402  [R0402]
R152  10K,1%  R-EU_R0402  [R0402]
R153  1K,1%  R-EU_R0402  [R0402]
R154  1K,1%  R-EU_R0402  [R0402]
R155  1K,1%  R-EU_R0402  [R0402]
R156  22R,1%  R-EU_R0402  [R0402]
R157  22R,1%  R-EU_R0402  [R0402]
R158  22R,1%  R-EU_R0402  [R0402]
R159  22R,1%  R-EU_R0402  [R0402]
R160  22R,1%  R-EU_R0402  [R0402]
R161  100  R-EU_R0402  [R0402]
R162  100  R-EU_R0402  [R0402]
R163  15K,1%  R-EU_R0402  [R0402]
R164  15K,1%  R-EU_R0402  [R0402]
R165  15K,1%  R-EU_R0402  [R0402]
R166  15K,1%  R-EU_R0402  [R0402]
R167  15K,1%  R-EU_R0402  [R0402]
R168  15K,1%  R-EU_R0402  [R0402]
R169  15K,1%  R-EU_R0402  [R0402]
R170  15K,1%  R-EU_R0402  [R0402]
R171  4.7K,1%  R-EU_R0402  [R0402]
R172  4.7K,1%  R-EU_R0402  [R0402]
R173  4.7K,1%  R-EU_R0402  [R0402]
R174  100K,1%  R-EU_R0402  [R0402]
R175  100K,1%  R-EU_R0402  [R0402]
R176  100K,1%  R-EU_R0402  [R0402]
R177  100K,1%  R-EU_R0402  [R0402]
R178  100K,1%  R-EU_R0402  [R0402]
R179  100K,1%  R-EU_R0402  [R0402]
R180  100  R-EU_R0402  [R0402]
R181  100  R-EU_R0402  [R0402]
SV1  MA04-1  [MA04-1]
SV2  DNI  MA04-2  [MA04-2]
SV3  DNI  MA04-2  [MA04-2]
SV5  MA04-1  [MA04-1]
SYS_5V  TPTP06R  [TP06R]
SYS_RTC_1V8  TPB1,27  [B1,27]
SYS_VDD1_3V3  TPTP10R  [TP10R]
SYS_VDD2_3V3  TPTP11R  [TP11R]
SYS_VDD3_3V3  TPB1,27  [B1,27]
U1  OSD3358-512M-BSM  [OSD335X-BGA-256]
U2  TUSB2046BIRHBT  [QFN50P500X500X100-33N]
U3  TPS2061D  [SOIC127P600X175-8N]
U4  TPD4S012_DRY_6_P1_P  [DRY6]
U5  UA78L05ACD  [SOIC127P600X175-8N]
U6  TPD4S012_DRY_6_P1_P  [DRY6]
U7  TLVH431  [SOT23-3]
U8  TPD4S012_DRY_6_P1_P  [DRY6]
U9  TPD4S012_DRY_6_P1_P  [DRY6]
U10  TPD4S012_DRY_6_P1_P  [DRY6]
U11  SN74AHC595PW  [SOP65P640X120-16N]
U12  APX811SOT  [SOT143-R]
U13  INA199A1DCKR  [SOT65P210X110-6N]
U19  CD4050BD  [SOIC127P600X175-16N]
U$2  TRINAMIC_TMC2130_QFN36  [TRINAMIC_QFN36]
U$3  LPJ0011BBNL  [LPJ0011BBNL]
U$4  CC-BY-SA  [CC-BY-SA]
U$5  USB-A  [USB-A]
U$6  USB-A  [USB-A]
U$7  TDA19988BHN/C1,557  [SOT804-4]
U$8  USB-MICRO  [USB-MICRO]
U$9  TRINAMIC_TMC2130_QFN36  [TRINAMIC_QFN36]
U$10  TPS54202  [SOT23]
U$11  SISS27DN  [POWERPAK-1212-8S]
U$13  TRINAMIC_TMC2130_QFN36  [TRINAMIC_QFN36]
U$14  TRINAMIC_TMC2130_QFN36  [TRINAMIC_QFN36]
U$15  TRINAMIC_TMC2130_QFN36  [TRINAMIC_QFN36]
U$16  TRINAMIC_TMC2130_QFN36  [TRINAMIC_QFN36]
U$17  SISS27DN  [POWERPAK-1212-8S]
U$18  TPD12S016-RKT  [R-PDSO-G24]
U$19  TACT_SWITCH  [DHT-1147]
U$20  TACT_SWITCH  [DHT-1147]
U$21  TACT_SWITCH  [DHT-1147]
VDD_CODE  TPTP10R  [TP10R]
VDD_MPU  TPTP11R  [TP11R]
VDDS_DDR  TPTP10R  [TP10R]
VDDS_PLL  TPTP11R  [TP11R]
X1  22-05-7038-03  [7395-03]
X2  MSTBA4  [MSTBA4]
X3  MSTBA2  [MSTBA2]
X4  22-05-7028-02  [7395-02]
X5  22-05-7028-02  [7395-02]
X6  22-05-7028-02  [7395-02]
X7  22-05-7038-03  [7395-03]
X8  22-05-7038-03  [7395-03]
X9  22-05-7028-02  [7395-02]
X10  22-05-7038-03  [7395-03]
X11  22-05-7038-03  [7395-03]
X12  22-05-7048-04  [7395-04]
X13  22-05-7038-03  [7395-03]
X14  22-05-7048-04  [7395-04]
X15  22-05-7048-04  [7395-04]
X16  22-05-7048-04  [7395-04]
X17  22-05-7048-04  [7395-04]
X18  22-05-7048-04  [7395-04]
X19  22-05-7038-03  [7395-03]
X20  MSTBA4  [MSTBA4]
X21  MSTBA2  [MSTBA2]
X22  22-05-7038-03  [7395-03]
X24  HDMI4  [HDMI-A-TH]
X25  22-05-7048-04  [7395-04]
X26  MSTBA2  [MSTBA2]
X29  22-05-7038-03  [7395-03]
Y1  25MHz  445C33D24M00000SMALL  [445C33D24M00000]
Y2  25MHz  445C33D24M00000SMALL  [445C33D24M00000]
Y4  6 MHz  445C33D24M00000  [NX8045GB-6MHZ-STD-CSF-3]

## Nets
5VIN_Y: C72.1 R59.2 U$13.26(VCC)
5VOUT_A: C55.2 R72.1 R73.2 U$16.25(5VOUT)
5VOUT_E: C65.2 R35.2 R71.1 U$14.25(5VOUT)
5VOUT_H: C68.2 R31.2 R52.1 U$15.25(5VOUT)
5VOUT_X: C86.2 R126.1 R140.2 U$2.25(5VOUT)
5VOUT_Y: C33.2 R37.2 R59.1 U$13.25(5VOUT)
5VOUT_Z: C37.2 R27.2 R70.1 U$9.25(5VOUT)
+5V [power]: C36.2 C48.1 C80.1 L1.P$1 R12.1 U1.P10(A:VIN_AC) U1.R10(A:VIN_AC) U1.T10(A:VIN_AC)
+12V: C5.2 U5.1(OUT) X12.4
+24V [power]: C4.1 C6.2 C8.1 C10.1 C15.1 C16.1 C28.2 C32.2 C35.2 C38.2 C40.1 C41.1 C42.+ C54.2 C56.2 C64.2 C66.2 C67.2 C69.2 C85.2 C89.1 C91.1 C92.1 C93.1 C94.+ C95.+ C97.+ C98.+ C99.2 C100.1 C101.+ D1.C D2.C D3.C D4.C R26.1 U5.8(IN) U13.5(IN-) U$2.16(VS) U$2.30(VSA) U$2.31(VS) U$9.16(VS) U$9.30(VSA) U$9.31(VS) U$13.16(VS) U$13.30(VSA) U$13.31(VS) U$14.16(VS) U$14.30(VSA) U$14.31(VS) U$15.16(VS) U$15.30(VSA) U$15.31(VS) U$16.16(VS) U$16.30(VSA) U$16.31(VS) X3.1 X4.1 X5.1 X6.1 X9.1 X20.1 X20.2 X21.1 X26.1
+24V_FOR_5V [power]: C1.2 C47.1 D5.C U$10.3(VIN)
A7-RFU-V5: IC30.A7(NC)
CGND: MGT1.P$1 MGT2.P$1 MGT3.P$1 MGT4.P$1 R149.2 U$3.SHD1 U$3.SHD2 U$5.A9(SHD1) U$5.A10(SHD2) U$5.A11(SHD3) U$5.A12(SHD4) U$6.A9(SHD1) U$6.A10(SHD2) U$6.A11(SHD3) U$6.A12(SHD4) U$8.P$6(GND) U$8.P$7(GND) U$8.P$8(GND) U$8.P$9(GND) U$8.P$10(GND) U$8.P$11(GND) X24.P$1(GND) X24.P$2(GND) X24.P$3(GND) X24.P$4(GND)
DIR_A: U1.A16(C:MMC0_DAT0) U$16.7(REFR_DIR)
DIR_B: SV2.5 U1.B15(C:MMC0_CLK)
DIR_C: SV3.5 U1.R6(C:GPMC_AD13)
DIR_E: U1.C4(C:MCASP0_AHCLKX) U$14.7(REFR_DIR)
DIR_H: U1.C16(C:MMC0_DAT2) U$15.7(REFR_DIR)
DIR_X: U1.A2(C:MCASP0_FSX) U$2.7(REFR_DIR)
DIR_Y: U1.B1(C:MCASP0_AHCLKR) U$13.7(REFR_DIR)
DIR_Z: U1.B3(C:MCASP0_FSR) U$9.7(REFR_DIR)
DVI_+5V: C21.1 U$18.P$13(5V_OUT) X24.18(+5V)
E5-RFU-V5: IC30.E5(NC)
EEPROM_WP: EEPROM_WP.TP U1.M2(A:EEPROM_WP)
EMMC_RST: IC30.K5(RST_N) R137.1 U1.B4(C:XDMA_EVENT_INTR1)
EMMV_VCCI: C138.1 IC30.C2(VDDIM)
EMU0: J1.13(EMU0) R171.2 U1.E2(B:EMU0)
EMU1: J1.14(EMU1) R172.2 U1.E3(B:EMU1)
EN_TK_A: Q14.1(G1) Q14.3(G2) R142.2 U11.3(QD) X11.1
EN_TK_E: Q10.1(G1) Q10.3(G2) R76.2 U11.15(QA) X29.1
EN_TK_H: Q11.1(G1) Q11.3(G2) R92.2 U11.1(QB) X7.1
EN_TK_HBP: Q13.1(G1) Q13.3(G2) R93.2 U11.2(QC) X8.1
ENABLE_B: SV2.3 U11.6(QG)
ENABLE_C: SV3.3 U11.7(QH)
ENABLE_STUFF: Q12.1(B) R91.1 R112.2 U1.J15(B:USB0_DRVVBUS)
END_STOP_X1: U1.N14(C:GPMC_BEN1) U19.2(G=A)
END_STOP_X2: U1.R12(C:GPMC_A1) U19.10(J=D)
END_STOP_X_1_IN: R61.1 U19.3(A) X22.1
END_STOP_X_2_IN: IC6.4(O) R64.1 U19.9(D) X10.1
END_STOP_Y1: U1.T16(C:GPMC_A11) U19.4(H=B)
END_STOP_Y2: U1.P3(C:GPMC_CSN0) U19.12(K=E)
END_STOP_Y_1_IN: R62.1 U19.5(B) X1.1
END_STOP_Y_2_IN: IC7.4(O) R65.1 U19.11(E) X19.1
END_STOP_Z1: U1.T6(C:GPMC_AD14) U19.6(I=C)
END_STOP_Z2: U1.P7(C:GPMC_AD15) U19.15(L=F)
END_STOP_Z_1_IN: R63.1 U19.7(C) X13.1
END_STOP_Z_2_IN: R66.1 U19.14(F) X12.1
FAN0: Q6.1(B) R25.2 R34.2 U1.P12(C:GPMC_A2)
FAN1: Q7.1(B) R19.2 R33.2 U1.T13(C:GPMC_A3)
FAN2: Q4.1(B) R20.2 R32.2 U1.T4(C:GPMC_AD8)
FAN3: Q5.1(B) R5.2 R21.2 U1.P5(C:GPMC_AD9)
FAULT_A: R44.1 U1.R5(C:GPMC_AD10) U$16.20(SWN_DIAG0) U$16.21(SWP_DIAG1)
FAULT_E: R36.1 U1.T7(C:GPMC_CLK) U$14.20(SWN_DIAG0) U$14.21(SWP_DIAG1)
FAULT_H: R51.1 U1.J14(D:RMII1_REF_CLK) U$15.20(SWN_DIAG0) U$15.21(SWP_DIAG1)
FAULT_X: R143.2 U1.T5(C:GPMC_AD11) U$2.20(SWN_DIAG0) U$2.21(SWP_DIAG1)
FAULT_Y: R144.2 U1.R7(C:GPMC_CSN3) U$13.20(SWN_DIAG0) U$13.21(SWP_DIAG1)
FAULT_Z: R28.1 U1.T12(C:GPMC_A0) U$9.20(SWN_DIAG0) U$9.21(SWP_DIAG1)
GND [power]: C1.1 C4.2 C5.1 C6.1 C8.2 C10.2 C12.2 C13.2 C14.2 C15.2 C16.2 C17.2 C18.1 C19.2 C20.1 C21.2 C23.2 C24.2 C25.- C26.2 C27.2 C28.1 C29.2 C30.2 C31.2 C32.1 C33.1 C34.2 C37.1 C40.2 C41.2 C42.- C44.2 C45.2 C46.2 C47.2 C48.2 C53.2 C54.1 C55.1 C57.2 C58.2 C59.2 C60.2 C61.2 C63.2 C64.1 C65.1 C67.1 C68.1 C70.2 C72.2 C73.2 C74.2 C80.2 C82.2 C83.2 C84.2 C85.1 C86.1 C87.2 C89.2 C91.2 C92.2 C93.2 C94.- C95.- C97.- C98.- C100.2 C101.- C102.2 C103.2 C108.2 C109.2 C110.2 C111.2 C112.2 C113.2 C114.2 C115.2 C132.2 C133.2 C134.2 C135.2 C136.2 C138.2 C140.2 C141.2 C142.2 C143.2 C148.2 C149.2 C150.2 C155.2 C156.1 C157.1 IC1.3(GND) IC6.3(GND) IC7.3(GND) IC29.33(GND_EP) IC30.C4(VSSQ) IC30.E7(VSS) IC30.G5(VSS) IC30.H10(VSS) IC30.K8(VSS) IC30.N2(VSSQ) IC30.N5(VSSQ) IC30.P4(VSSQ) IC30.P6(VSSQ) J1.4(TDIS) J1.8(GND1) J1.10(GND2) J1.12(GND3) J1.16(GND4) J1.20(GND5) J2.4 J3.4 LED0.C LED1.C LED2.C LED3.C LED4.C LED5.C LED6.C LED7.C LED8.C LED9.C LED10.C LED11.C LED12.C LED13.C Q1.1(S) Q1.2(S) Q1.3(S) Q2.1(S) Q2.2(S) Q2.3(S) Q3.1(S) Q3.2(S) Q3.3(S) Q4.2(E) Q5.2(E) Q6.2(E) Q7.2(E) Q8.1(S) Q8.2(S) Q8.3(S) Q10.5(S1) Q11.5(S1) Q12.2(E) Q13.5(S1) Q14.5(S1) R3.1 R4.1 R5.1 R6.1 R7.1 R8.1 R9.1 R10.1 R11.1 R22.2 R29.1 R30.1 R32.1 R33.1 R34.1 R42.1 R43.1 R46.1 R47.1 R48.1 R50.1 R53.2 R54.2 R58.1 R60.1 R75.1 R76.1 R79.2 R80.2 R81.1 R82.1 R90.2 R91.2 R92.1 R93.1 R94.2 R106.1 R107.1 R108.1 R109.1 R110.1 R111.1 R114.2 R115.1 R116.1 R117.2 R121.2 R138.1 R139.1 R141.1 R142.1 R146.2 R149.1 R152.2 R163.2 R164.2 R165.2 R166.2 R167.2 R168.2 R169.2 R170.2 R173.2 R174.1 R175.1 R176.1 R177.1 R178.1 R179.1 SV1.1 SV2.1 SV3.1 SV5.1 U1.D8(E:DGND) U1.D9(E:DGND) U1.E5(E:DGND) U1.E6(E:DGND) U1.E7(E:DGND) U1.E8(E:DGND) U1.E9(E:DGND) U1.E10(E:DGND) U1.E11(E:DGND) U1.E12(E:DGND) U1.F5(E:DGND) U1.F12(E:DGND) U1.G5(E:DGND) U1.G12(E:DGND) U1.H4(E:DGND) U1.H5(E:DGND) U1.H12(E:DGND) U1.H13(E:DGND) U1.J4(E:DGND) U1.J5(E:DGND) U1.J12(E:DGND) U1.J13(E:DGND) U1.K5(E:DGND) U1.K12(E:DGND) U1.L5(E:DGND) U1.L12(E:DGND) U1.L14(B:USB1_ID) U1.M5(E:DGND) U1.M6(E:DGND) U1.M7(E:DGND) U1.M8(E:DGND) U1.M9(E:DGND) U1.M10(E:DGND) U1.M11(E:DGND) U1.M12(E:DGND) U1.N8(E:DGND) U1.N9(E:DGND) U2.7(GND) U2.8(BUSPWR) U2.27(TSTPLL/48MCLK) U2.28(GND_2) U2.31(TSTMODE) U2.33(EP) U3.1(GND) U4.4(GND) U5.2(COM_2) U5.3(COM_3) U5.6(COM_4) U5.7(COM) U6.4(GND) U8.4(GND) U9.4(GND) U10.4(GND) U11.8(GND) U11.13(~OE) U12.1(GND) U13.1(REF) U13.2(GND) U19.8(VSS) U$2.1(CLK) U$2.11(GND) U$2.12(GND) U$2.17(ENCN_DCO) U$2.22(DRV_ENN_CFG6) U$2.24(GNDA) U$2.35(GND) U$2.36(TST_MODE) U$2.GND_PAD(GND) U$3.8(GND) U$5.4(GND) U$5.8(GND) U$6.4(GND) U$6.8(GND) U$7.8(VPB[1]) U$7.9(VPB[0]) U$7.16(VPC[2]) U$7.17(VPC[1]) U$7.18(VPC[0]) U$7.19(VPP) U$7.49(TEST) U$7.53(A0_I2C) U$7.54(A1_I2C) U$7.61(VPA[2]) U$7.62(VPA[1]) U$7.63(VPA[0]) U$7.P$1(GND.PAD) U$8.P$5 U$9.1(CLK) U$9.11(GND) U$9.12(GND) U$9.17(ENCN_DCO) U$9.22(DRV_ENN_CFG6) U$9.24(GNDA) U$9.35(GND) U$9.36(TST_MODE) U$9.GND_PAD(GND) U$10.1(GND) U$13.1(CLK) U$13.11(GND) U$13.12(GND) U$13.17(ENCN_DCO) U$13.22(DRV_ENN_CFG6) U$13.24(GNDA) U$13.35(GND) U$13.36(TST_MODE) U$13.GND_PAD(GND) U$14.1(CLK) U$14.11(GND) U$14.12(GND) U$14.17(ENCN_DCO) U$14.22(DRV_ENN_CFG6) U$14.24(GNDA) U$14.35(GND) U$14.36(TST_MODE) U$14.GND_PAD(GND) U$15.1(CLK) U$15.11(GND) U$15.12(GND) U$15.17(ENCN_DCO) U$15.22(DRV_ENN_CFG6) U$15.24(GNDA) U$15.35(GND) U$15.36(TST_MODE) U$15.GND_PAD(GND) U$16.1(CLK) U$16.11(GND) U$16.12(GND) U$16.17(ENCN_DCO) U$16.22(DRV_ENN_CFG6) U$16.24(GNDA) U$16.35(GND) U$16.36(TST_MODE) U$16.GND_PAD(GND) U$18.P$6(GND) U$18.P$14(GND) U$18.P$19(GND) U$19.2 U$20.4 U$21.4 X1.2 X2.1 X2.2 X7.3 X8.3 X10.2 X11.3 X12.2 X13.2 X19.2 X22.2 X24.2(TMDS_DATA2_SHIELD) X24.5(TMDS_DATA1_SHIELD) X24.8(TMDS_DATA0_SHIELD) X24.11(TMDS_CLOCK_SHIELD) X24.17(DDC/CEC-GRND) X29.3
GNDA_ADC: C22.2 C107.2 C151.2 U1.A9(B:AGND_ADC) U1.B9(B:VREFN)
HDMI_1V8: C12.1 C29.1 C31.1 C108.1 C109.1 C110.1 C111.1 C112.1 C113.1 C114.1 C115.1 L3.1 U$7.5(VDDDC1) U$7.14(VDDD1(IO)(1V8)) U$7.29(VDDDC2) U$7.35(VDDA(1V8)) U$7.36(VDDA3(TX)(1V8)) U$7.41(VDDA2(TX)(1V8)) U$7.46(VDDA1(TX)(1V8)) U$7.47(VDDA1(PLL)(1V8)) U$7.48(VDDA2(PLL)(1V8)) U$7.55(VDDD2(IO)(1V8))
HDMI_HPD: U$7.31(HPD) U$18.P$4(HPD_A) U$18.P$5(LS_OE)
HDMI_INT: U1.R15(C:GPMC_A10) U$7.50(INT)
HEATER_A: R74.2 R75.2 R181.2 U1.N1(C:GPMC_OEN_REN)
HEATER_E: R15.2 R47.2 R161.2 U1.M1(C:GPMC_ADVN_ALE)
HEATER_H: R14.2 R48.2 R162.2 U1.N3(C:GPMC_BEN0_CLE)
HEATER_HBP: R16.2 R46.2 R180.2 U1.N2(C:GPMC_WEN)
I2C0_SCL: U1.C10(A:I2C0_SCL) U1.D10(A:PMIC_SCL) U$7.52(CSCL)
I2C0_SDA: U1.C11(A:I2C0_SDA) U1.D11(A:PMIC_SDA) U$7.51(CSDA)
I2C1_SCL: J2.1 U1.B11(C:UART1_TXD)
I2C1_SDA: J2.2 U1.A11(C:UART1_RXD)
I_MEASURE: U1.C9(B:AIN6) U13.6(OUT)
IREF_E: R35.1 R60.2 U$14.23(AIN_IREF)
IREF_H: R31.1 R50.2 U$15.23(AIN_IREF)
IREF_X: R140.1 R141.2 U$2.23(AIN_IREF)
IREF_Y: R6.2 R37.1 U$13.23(AIN_IREF)
IREF_Z: R27.1 R58.2 U$9.23(AIN_IREF)
LCD_D0: R116.2 U1.G3(D:LCD_DATA0) U$7.15(VPC[3])
LCD_D1: R115.2 U1.G2(D:LCD_DATA1) U$7.13(VPC[4])
LCD_D2: R120.1 U1.G1(D:LCD_DATA2) U$7.12(VPC[5])
LCD_D3: R119.1 U1.H3(D:LCD_DATA3) U$7.11(VPC[6])
LCD_D4: R118.1 U1.H2(D:LCD_DATA4) U$7.10(VPC[7]) U$21.2
LCD_D5: R117.1 U1.H1(D:LCD_DATA5) U$7.7(VPB[2])
LCD_D6: R179.2 U1.J3(D:LCD_DATA6) U$7.6(VPB[3])
LCD_D7: R178.2 U1.J2(D:LCD_DATA7) U$7.3(VPB[4])
LCD_D8: R177.2 U1.J1(D:LCD_DATA8) U$7.2(VPB[5])
LCD_D9: R176.2 U1.K3(D:LCD_DATA9) U$7.1(VPB[6])
LCD_D10: R175.2 U1.K2(D:LCD_DATA10) U$7.64(VPB[7])
LCD_D11: R174.2 U1.K1(D:LCD_DATA11) U$7.60(VPA[3])
LCD_D12: R108.2 U1.L3(D:LCD_DATA12) U$7.59(VPA[4])
LCD_D13: R107.2 U1.L2(D:LCD_DATA13) U$7.58(VPA[5])
LCD_D14: R114.1 U1.L1(D:LCD_DATA14) U$7.57(VPA[6])
LCD_D15: R105.2 U1.M3(D:LCD_DATA15) U$7.56(VPA[7])
LCD_DE: U1.E1(D:LCD_AC_BIAS_EN) U$7.20(DE/FREF)
LCD_HSYNC: U1.F2(D:LCD_HSYNC) U$7.22(HSYNC/HREF)
LCD_PCLK: U1.F1(D:LCD_PCLK) U$7.4(PCLK)
LCD_VSYNC: U1.F3(D:LCD_VSYNC) U$7.21(VSYNC/VREF)
MDIO_CLK: IC29.17(MDC) U1.D13(D:MDC)
MDIO_DATA: IC29.16(MDIO) R85.2 U1.E13(D:MDIO)
MII1_COL: R103.2 U1.F15(D:MII1_COL)
MII1_CRS_DV: R104.2 U1.F14(D:MII1_CRS)
MII1_RXCLK: R100.2 U1.E16(D:MII1_RX_CLK)
MII1_RXD0: R99.2 U1.E14(D:MII1_RXD0)
MII1_RXD1: R97.2 U1.D16(D:MII1_RXD1)
MII1_RXD2: R96.2 U1.D15(D:MII1_RXD2)
MII1_RXD3: R95.2 U1.D14(D:MII1_RXD3)
MII1_RXDV: R98.2 U1.F16(D:MII1_RX_DV)
MII1_RXERR: R101.2 U1.E15(D:MII1_RX_ER)
MII1_TXCLK: R102.2 U1.H16(D:MII1_TX_CLK)
MII1_TXD0: IC29.22(TXD0) U1.H15(D:MII1_TXD0)
MII1_TXD1: IC29.23(TXD1) U1.H14(D:MII1_TXD1)
MII1_TXD2: IC29.24(TXD2) U1.G16(D:MII1_TXD2)
MII1_TXD3: IC29.25(TXD3) U1.G15(D:MII1_TXD3)
MII1_TXEN: IC29.21(TXEN) U1.G14(D:MII1_TX_EN)
MMC1_CLK: IC30.M6(CLK) R136.1 U1.P2(C:GPMC_CSN1)
MMC1_CMD: IC30.M5(CMD) R135.1 U1.P1(C:GPMC_CSN2)
MMC1_DAT0: IC30.A3(DAT0) R127.1 U1.R3(C:GPMC_AD0)
MMC1_DAT1: IC30.A4(DAT1) R128.1 U1.R2(C:GPMC_AD1)
MMC1_DAT2: IC30.A5(DAT2) R129.1 U1.R1(C:GPMC_AD2)
MMC1_DAT3: IC30.B2(DAT3) R130.1 U1.T3(C:GPMC_AD3)
MMC1_DAT4: IC30.B3(DAT4) R131.1 U1.T2(C:GPMC_AD4)
MMC1_DAT5: IC30.B4(DAT5) R132.1 U1.T1(C:GPMC_AD5)
MMC1_DAT6: IC30.B5(DAT6) R133.1 U1.P4(C:GPMC_AD6)
MMC1_DAT7: IC30.B6(DAT7) R134.1 U1.R4(C:GPMC_AD7)
MODE2: IC29.15(COL/CRS_DV/MODE2) R103.1 R155.2
N$1: R41.1 R88.2 U7.1(REF)
N$2: U$13.13(OB1) X15.3
N$3: C3.2 U$13.27(CPO)
N$4: Q9.B R49.2 U7.2(CATHODE)
N$5: C2.2 U$10.6(BOOT)
N$6: U$9.34(OA1) X16.1
N$8: Q12.3(C) R86.2
N$9: LED5.A R19.1
N$11: Q6.3(C) X9.2
N$12: C9.2 U$15.27(CPO)
N$13: R9.2 U$15.14(BRB)
N$14: C7.2 U$9.27(CPO)
N$15: R7.2 U$9.14(BRB)
N$16: U$9.32(OA2) X16.2
N$17 [power]: R24.2 R53.1 U$17.G
N$18: R113.1 U2.6(EEDATA/GANGED)
N$19: U$13.32(OA2) X15.2
N$20: U$13.34(OA1) X15.1
N$21: LED0.A R25.1
N$22: U$14.34(OA1) X17.1
N$23: C36.1 R12.2 R22.1 U$10.4(FB)
N$24: R8.2 U$9.33(BRA)
N$25: Q5.3(C) X6.2
N$26: R84.2 R86.1 U$11.G
N$27: C7.1 U$9.28(CPI)
N$28: U$14.32(OA2) X17.2
N$29: U$9.15(OB2) X16.4
N$30: R10.2 U$15.33(BRA)
N$31: U$18.P$10(HPD_B) X24.19(HOT_PLUG_DETECT)
N$32: U$15.34(OA1) X18.1
N$33: Q10.6(D1) R1.1
N$34: U1.F4(F:VDDS_DDR) VDDS_DDR.TP
N$35: R3.2 U$13.14(BRB)
N$36: R4.2 U$13.33(BRA)
N$37: U$9.13(OB1) X16.3
N$38: U$15.32(OA2) X18.2
N$39: U$14.13(OB1) X17.3
N$40: U1.G4(F:VDD_CORE) VDD_CODE.TP
N$41: C3.1 U$13.28(CPI)
N$42: LED8.A R112.1
N$43: R147.2 U2.23(DM4)
N$44: U$16.34(OA1) X25.1
N$45: U$13.15(OB2) X15.4
N$46: U$16.32(OA2) X25.2
N$47: Q10.4(D2) R18.2
N$48: C35.1 U$13.29(VCP)
N$49: R43.2 R73.1 U$16.23(AIN_IREF)
N$50: Q13.6(D1) R56.1
N$51: R148.2 U2.19(DM3)
N$52: C38.1 U$9.29(VCP)
N$53: Q14.6(D1) R57.1
N$54: R151.2 U2.15(DM2)
N$55: U$18.P$9(SDA_B) X24.16(SDA)
N$56: U$18.P$8(SCL_B) X24.15(SCL)
N$57: U$18.P$7(CEC_B) X24.13(CEC)
N$58: Q11.4(D2) R17.2
N$59: Q13.4(D2) R13.2
N$60: Q14.4(D2) R77.2
N$61: R156.2 U2.11(DM1)
N$62: R157.2 U2.24(DP4)
N$63: R158.2 U2.20(DP3)
N$64: C57.1 D3.A Q2.5(D) Q2.6(D) Q2.7(D) Q2.8(D) Q2.TH(D) X21.2
N$65: Q11.6(D1) R55.1
N$66: R159.2 U2.16(DP2)
N$67: R160.2 U2.12(DP1)
N$68: Q3.4(G) R161.1
N$69: Q2.4(G) R162.1
N$70: C39.2 U$14.27(CPO)
N$71: R29.2 U$14.14(BRB)
N$72: R30.2 U$14.33(BRA)
N$73: Q1.4(G) R180.1
N$74: IC1.2(I) U1.N12(A:PMIC_PGOOD) U1.P11(A:PWRONRSTN)
N$75: C39.1 U$14.28(CPI)
N$76: IC1.1(OE) R2.2 U$19.4
N$77: U$14.15(OB2) X17.4
N$78: IC1.4(O) R90.1 U12.3(MR#)
N$79: J1.15(SRST)
N$80: C66.1 U$14.29(VCP)
N$81: Q8.4(G) R181.1
N$90: C9.1 U$15.28(CPI)
N$92: U$15.15(OB2) X18.4
N$96: C11.2 U$16.27(CPO)
N$98: C69.1 U$15.29(VCP)
N$109: C73.1 R70.2 U$9.26(VCC)
N$113: U$15.13(OB1) X18.3
N$115: Q4.3(C) X5.2
N$116: Q7.3(C) X4.2
N$117: LED6.A R20.1
N$118: LED7.A R21.1
N$122: LED9.A R23.1
N$123: LED10.A R67.1
N$124: LED11.A R68.1
N$125: LED12.A R69.1
N$126: R11.2 U$16.14(BRB)
N$127: LED3.A R15.1
N$128: R42.2 U$16.33(BRA)
N$129: LED1.A R14.1
N$130: LED2.A R16.1
N$132: C11.1 U$16.28(CPI)
N$134: U$16.15(OB2) X25.4
N$137: C56.1 U$16.29(VCP)
N$145: C60.1 R72.2 U$16.26(VCC)
N$147: U$16.13(OB1) X25.3
N$149: LED4.A R74.1
N$150 [power]: C102.1 D4.A Q8.5(D) Q8.6(D) Q8.7(D) Q8.8(D) Q8.TH(D) X26.2
N$151: R77.1 R78.1 X11.2
N$153: R79.1 U$3.11(YELC)
N$154: R80.1 U$3.10(GRNC)
N$155: IC29.3(LED1/REGOFF) U$3.9(GRNA)
N$156: IC29.2(LED2/NINTSEL) R121.1 U$3.12(YELA)
N$162: PMIC_NRESET.TP U1.M13(A:PMIC_NRESET)
N$163: IC29.18(NINT/TXER/TXD4) R81.2
N$164: IC29.32(RBIAS) R82.2
N$167: C87.1 R126.2 U$2.26(VCC)
N$168: C88.2 U$2.27(CPO)
N$169: U$7.30(CEC) U$18.P$1(CEC_A)
N$170: C88.1 U$2.28(CPI)
N$171: C99.1 U$2.29(VCP)
N$172: R138.2 U$2.14(BRB)
N$173: R139.2 U$2.33(BRA)
N$176: C146.2 R150.1 U1.P16(B:OSC0_IN) Y1.P$1
N$177: C146.1 C147.1 U1.N15(B:OSC0_GND)
N$179: U1.T11(A:PMIC_PB_IN) U$20.2
N$180: C148.1 IC29.5(XTAL1/CLKIN) Y2.P$2
N$181: C149.1 R83.2 Y2.P$1
N$183: IC29.4(XTAL2) R83.1
N$184: C147.2 R150.2 U1.N16(B:OSC0_OUT) Y1.P$2
N$201: LED13.A R89.1
N$204: R94.1 U$7.34(EXT_SWING)
N$207: U$7.33(DSCL) U$18.P$2(SCL_A)
N$208: U$7.32(DSDA) U$18.P$3(SDA_A)
N$214: C156.2 U2.29(XTAL2) Y4.P$2
N$228: IC29.26(RXDV) R98.1
N$231: IC29.20(TXCLK) R102.1
N$234: C59.1 D1.A Q3.5(D) Q3.6(D) Q3.7(D) Q3.8(D) Q3.TH(D) X3.2
N$237: R13.1 R38.1 X8.2
N$240: R18.1 R40.1 X29.2
N$241: R17.1 R39.1 X7.2
N$242: C58.1 D2.A Q1.5(D) Q1.6(D) Q1.7(D) Q1.8(D) Q1.TH(D) X20.3 X20.4
N$251: IC29.14(CRS) R104.1
P-SHUNT: R26.2 U13.4(IN+) U$11.D1(D) U$11.D2(D) U$11.D3(D) U$11.D4(D) U$11.D5(D)
PMIC_LDO_PGOOD: U1.N4(A:PMIC_LDO_PGOOD) U1.N5(A:RTC_PWRONRSTN)
PMIC_MUX: U1.C8(B:AIN5) U1.D6(B:PMIC_MUX_OUT)
PMIC_NINT: U1.D4(A:EXTINTN) U1.E4(A:PMIC_NINT)
PMIC_NWAKEUP: U1.L4(A:PMIC_NWAKEUP) U1.M4(A:EXT_WAKEUP)
PMIC_PWR_EN: U1.N10(A:PMIC_POWER_EN) U1.N11(A:PMIC_PWR_EN)
QUAD_ENCODER_A: SV5.3 U1.R13(C:GPMC_A4)
QUAD_ENCODER_B: SV5.2 U1.P13(C:GPMC_A5)
REFCLK0: IC29.7(RXCLK/PHYAD1) R100.1 R106.2
RTC_KALDO_ENN: R152.1 U1.M16(A:RTC_KALDO_ENN)
RXD0: IC29.11(RXD0/MODE0) R99.1 R153.2
RXD1: IC29.10(RXD1/MODE1) R97.1 R154.2
RXD2: IC29.9(RXD2/RMIISEL) R96.1 R109.2
RXD3: IC29.8(RXD3/PHYAD2) R95.1 R110.2
RXER: IC29.13(RXER/RXD4/PHYAD0) R101.1 R111.2
RXN: IC29.30(RXN) R122.2 U$3.2(RD-)
RXP: IC29.31(RXP) R123.2 U$3.1(RD+)
SERVO_0: IC6.2(I) SV1.3 U1.B12(C:UART0_TXD)
SERVO_0_EN: IC6.1(OE) U11.4(QE)
SERVO_1: IC7.2(I) SV1.4 U1.A12(C:UART0_RXD)
SERVO_1_EN: IC7.1(OE) U11.5(QF)
SPI0_CS0: U1.A14(C:SPI0_CS0) U$2.2(CSN_CFG3) U$9.2(CSN_CFG3) U$13.2(CSN_CFG3) U$14.2(CSN_CFG3) U$15.2(CSN_CFG3) U$16.2(CSN_CFG3)
SPI0_CS1: U1.C14(C:SPI0_CS1) U11.12(RCLK)
SPI0_MISO: U1.B13(C:SPI0_D0) U$16.5(SDO_NAO_CFG0)
SPI0_MISO_E: U$14.5(SDO_NAO_CFG0) U$15.4(SDI_NAI_CFG1)
SPI0_MISO_H: U$15.5(SDO_NAO_CFG0) U$16.4(SDI_NAI_CFG1)
SPI0_MISO_X: U$2.5(SDO_NAO_CFG0) U$13.4(SDI_NAI_CFG1)
SPI0_MISO_Y: U$9.4(SDI_NAI_CFG1) U$13.5(SDO_NAO_CFG0)
SPI0_MISO_Z: U$9.5(SDO_NAO_CFG0) U$14.4(SDI_NAI_CFG1)
SPI0_MOSI: U1.B14(C:SPI0_D1) U11.14(SER) U$2.4(SDI_NAI_CFG1)
SPI0_SCLK: U1.A13(C:SPI0_SCLK) U11.11(SRCLK) U$2.3(SCK_CFG2) U$9.3(SCK_CFG2) U$13.3(SCK_CFG2) U$14.3(SCK_CFG2) U$15.3(SCK_CFG2) U$16.3(SCK_CFG2)
SPI1_CS0: SV3.4 U1.B10(C:UART1_CTSN)
SPI1_CS1: SV2.4 U1.A10(C:UART1_RTSN)
SPI1_MISO: SV2.6 SV3.6 U1.C12(C:UART0_CTSN)
SPI1_MOSI: SV2.8 SV3.8 U1.C13(C:UART0_RTSN)
SPI1_SCLK: SV2.2 SV3.2 U1.C5(C:ECAP0_IN_PWM0_OUT)
STEP_A: U1.A15(C:MMC0_DAT1) U$16.6(REFL_STEP)
STEP_B: SV2.7 U1.B16(C:MMC0_CMD)
STEP_C: SV3.7 U1.P6(C:GPMC_AD12)
STEP_E: U1.C3(C:MCASP0_AXR1) U$14.6(REFL_STEP)
STEP_H: U1.C15(C:MMC0_DAT3) U$15.6(REFL_STEP)
STEP_X: U1.A1(C:MCASP0_ACLKX) U$2.6(REFL_STEP)
STEP_Y: U1.B2(C:MCASP0_AXR0) U$13.6(REFL_STEP)
STEP_Z: U1.A3(C:MCASP0_ACLKR) U$9.6(REFL_STEP)
SW [power]: C2.1 L1.P$2 U$10.2(SW)
SYS_5V: C18.2 C19.1 C24.1 C25.+ C82.1 C83.1 IC6.5(VCC) IC7.5(VCC) R61.2 R62.2 R63.2 R64.2 R65.2 R66.2 R87.2 SYS_5V.TP U1.K6(A:SYS_VOUT) U1.K7(A:SYS_VOUT) U1.L6(A:SYS_VOUT) U1.L7(A:SYS_VOUT) U3.2(IN_2) U3.3(IN) U11.10(~SRCLR) U11.16(VCC) U$18.P$11(VCC5V) X1.3 X10.3 X12.3 X13.3 X19.3 X22.3
SYS_RESETN: IC29.19(NRST) U1.R11(A:WARMRSTN) U2.4(~RESET) U12.2(RESET#)
SYS_RTC_1V8: Q9.C R41.2 SYS_RTC_1V8.TP U1.K11(A:SYS_RTC_1P8V) U1.L11(A:SYS_RTC_1P8V) U7.3(ANODE)
SYS_VDD1_3V3: C13.1 C20.2 C23.1 C27.1 C30.1 C44.1 C53.1 C61.1 C63.1 C84.1 C140.1 C141.1 C142.1 C143.1 C150.1 C155.1 IC1.5(VCC) IC29.12(VDDIO) IC30.C6(VCCQ) IC30.E6(VCC) IC30.F5(VCC) IC30.J10(VCC) IC30.K9(VCC) IC30.M4(VCCQ) IC30.N4(VCCQ) IC30.P3(VCCQ) IC30.P5(VCCQ) J1.5(TVDD) L2.1 R2.1 R28.2 R36.2 R44.2 R51.2 R85.1 R105.1 R113.2 R118.2 R119.2 R120.2 R127.2 R128.2 R129.2 R130.2 R131.2 R132.2 R133.2 R134.2 R135.2 R136.2 R137.2 R143.1 R144.1 R153.1 R154.1 R155.1 R171.1 R172.1 SYS_VDD1_3V3.TP U1.F6(A:SYS_VDD1_3P3V) U1.F7(A:SYS_VDD1_3P3V) U1.G6(A:SYS_VDD1_3P3V) U1.G7(A:SYS_VDD1_3P3V) U2.3(VCC) U2.25(VCC_2) U2.26(~EXTMEM) U12.4(VCC) U13.3(V+) U19.1(VCC) U$2.8(VCC_IO) U$9.8(VCC_IO) U$13.8(VCC_IO) U$14.8(VCC_IO) U$15.8(VCC_IO) U$16.8(VCC_IO) U$18.P$12(CT_HPD) U$18.P$24(VCCA)
SYS_VDD2_3V3: J2.3 J3.3 R89.2 SV1.2 SV5.4 SYS_VDD2_3V3.TP U1.F11(A:SYS_VDD2_3P3V) U1.G11(A:SYS_VDD2_3P3V)
SYS_VDD3_3V3: Q9.E R49.1 R88.1 SYS_VDD3_3V3.TP U1.F8(A:SYS_VDD3_3P3V) U1.F9(A:VDDSHV4) U1.G8(A:SYS_VDD3_3P3V) U1.G9(A:VDDSHV5) U1.H7(A:SYS_VDD3_3P3V) U1.H8(A:SYS_VDD3_3P3V) U1.H9(A:VDDSHV6) U1.J7(A:SYS_VDD3_3P3V) U1.J8(A:SYS_VDD3_3P3V) U1.J9(A:VDDSHV1) U1.K8(A:SYS_VDD3_3P3V) U1.K9(A:VDDSHV2) U1.L8(A:SYS_VDD3_3P3V) U1.L9(A:VDDSHV3)
SYS_VDD_1V8: L3.2 U1.F10(A:SYS_VDD_1P8V) U1.G10(A:SYS_VDD_1P8V) U1.H10(A:SYS_VDD_1P8V) U1.H11(A:SYS_VDD_1P8V) U1.J10(A:SYS_VDD_1P8V) U1.J11(A:SYS_VDD_1P8V) U1.K10(A:SYS_VDD_1P8V) U1.L10(A:SYS_VDD_1P8V)
TCK: J1.9(TCKRTN) J1.11(TCK) U1.D1(B:TCK)
TDI: J1.3(TDI) U1.C1(B:TDI)
TDO: J1.7(TDO) U1.C2(B:TDO)
TERM_A: C103.1 R57.2 R78.2 U1.C6(B:AIN3)
TERM_E: C46.1 R1.2 R40.2 U1.A8(B:AIN0)
TERM_H: C26.1 R38.2 R56.2 U1.B6(B:AIN2)
TERM_HBP: C45.1 R39.2 R55.2 U1.B8(B:AIN1)
THERM_BOARD: R145.2 R146.1 U1.C7(B:AIN4)
TMS: J1.1(TMS) U1.D2(B:TMS)
TRSTN: J1.2(TRSTN) R173.1 U1.D3(B:TRSTN)
TX0+: U$7.40(TX0+) U$18.P$18(D0+) X24.7(TMDS_DATA0+)
TX0-: U$7.39(TX0-) U$18.P$17(D0-) X24.9(TMDS_DATA0-)
TX1+: U$7.43(TX1+) U$18.P$21(D1+) X24.4(TMDS_DATA1+)
TX1-: U$7.42(TX1-) U$18.P$20(D1-) X24.6(TMDS_DATA1-)
TX2+: U$7.45(TX2+) U$18.P$23(D2+) X24.1(TDMS_DATA2+)
TX2-: U$7.44(TX2-) U$18.P$22(D2-) X24.3(TMDS_DATA2-)
TXC+: U$7.38(TXC+) U$18.P$16(CLK+) X24.10(TMDS_CLOCK+)
TXC-: U$7.37(TXC-) U$18.P$15(CLK-) X24.12(TMDS_CLOCK-)
TXN: IC29.28(TXN) R124.2 U$3.6(TD-)
TXP: IC29.29(TXP) R125.2 U$3.3(TD+)
UART4_RXD: J3.1 U1.P15(C:GPMC_WAIT0)
UART4_TXD: J3.2 U1.R16(C:GPMC_WPN)
USB0_DM: U1.K16(B:USB0_DM) U10.1(D+) U$8.P$2
USB0_DP: U1.K15(B:USB0_DP) U10.2(D-) U$8.P$3
USB0_ID: U1.K14(B:USB0_ID) U10.3(ID) U$8.P$4
USB1_DM: U1.L16(B:USB1_DM) U2.2(DM0)
USB1_DM1: R156.1 R163.1 U9.2(D-) U$5.2(D-)
USB1_DM2: R151.1 R164.1 U6.2(D-) U$5.6(D-)
USB1_DM3: R148.1 R165.1 U4.2(D-) U$6.2(D-)
USB1_DM4: R147.1 R166.1 U8.2(D-) U$6.6(D-)
USB1_DP: U1.L15(B:USB1_DP) U2.1(DP0)
USB1_DP1: R160.1 R167.1 U9.1(D+) U$5.3(D+)
USB1_DP2: R159.1 R168.1 U6.1(D+) U$5.7(D+)
USB1_DP3: R158.1 R169.1 U4.1(D+) U$6.3(D+)
USB1_DP4: R157.1 R170.1 U8.1(D+) U$6.7(D+)
USB1_DRVVBUS: U1.M14(B:USB1_DRVVBUS)
USB_DC: U1.J16(B:USB0_VBUS) U1.P9(A:VIN_USB) U1.R9(A:VIN_USB) U1.T9(A:VIN_USB) U10.6(VBUS) U$8.P$1
USB_OC: R87.1 U2.10(~OVRCUR1) U2.14(~OVRCUR2) U2.18(~OVRCUR3) U2.22(~OVRCUR4) U3.5(~OC)
USB_PWR: U2.9(~PWRON1) U3.4(~EN+)
USB_VBUS: C14.1 C17.1 U1.M15(B:USB1_VBUS) U3.6(OUT_2) U3.7(OUT_3) U3.8(OUT) U4.6(VBUS) U6.6(VBUS) U8.6(VBUS) U9.6(VBUS) U$5.1(VBUS) U$5.5(VBUS) U$6.1(VBUS) U$6.5(VBUS)
USB_XTAL1: C157.2 U2.30(XTAL1) Y4.P$1
USR0: R69.2 U1.T15(C:GPMC_A9)
USR1: R68.2 U1.T14(C:GPMC_A6)
USR2: R67.2 U1.R14(C:GPMC_A7)
USR3: R23.2 U1.P14(C:GPMC_A8)
VCC_E: C74.1 R71.2 U$14.26(VCC)
VCC_H: C70.1 R52.2 U$15.26(VCC)
VDD_ADC: C22.1 C107.1 C151.1 Q10.2(S2) Q11.2(S2) Q13.2(S2) Q14.2(S2) R145.1 U1.A7(B:SYS_ADC_1P8V) U1.B7(B:VREFP)
VDD_MPU: U1.F13(F:VDD_MPU) VDD_MPU.TP
VDD_PHYA: C132.1 C133.1 C134.1 C135.1 IC29.1(VDD2A) IC29.27(VDD1A) L2.2 R122.1 R123.1 R124.1 R125.1 U$3.4(RCT) U$3.5(TCT)
VDDCR: C34.1 C136.1 IC29.6(VDDCR)
VDDS_PLL: U1.G13(F:VDDS_PLL) VDDS_PLL.TP
VIN [power]: D5.A R45.1 U$17.D1(D) U$17.D2(D) U$17.D3(D) U$17.D4(D) U$17.D5(D) X2.3 X2.4
VIN_MEASURE: R45.2 R54.1 U1.D7(B:AIN7)
VMID [power]: R24.1 R84.1 U$11.S1(S) U$11.S2(S) U$11.S3(S) U$17.S1(S) U$17.S2(S) U$17.S3(S)
X_A1: U$2.34(OA1) X14.1
X_A2: U$2.32(OA2) X14.2
X_B1: U$2.13(OB1) X14.3
X_B2: U$2.15(OB2) X14.4
Unconnected: IC30.A1(NC) IC30.A2(NC) IC30.A6(NC) IC30.A8(NC) IC30.A9(NC) IC30.A10(NC) IC30.A11(NC) IC30.A12(NC) IC30.A13(NC) IC30.A14(NC) IC30.B1(NC) IC30.B7(NC) IC30.B8(NC) IC30.B9(NC) IC30.B10(NC) IC30.B11(NC) IC30.B12(NC) IC30.B13(NC) IC30.B14(NC) IC30.C1(NC) IC30.C3(NC) IC30.C5(NC) IC30.C7(NC) IC30.C8(NC) IC30.C9(NC) IC30.C10(NC) IC30.C11(NC) IC30.C12(NC) IC30.C13(NC) IC30.C14(NC) IC30.D1(NC) IC30.D2(NC) IC30.D3(NC) IC30.D4(NC) IC30.D12(NC) IC30.D13(NC) IC30.D14(NC) IC30.E1(NC) IC30.E2(NC) IC30.E3(NC) IC30.E8(NC) IC30.E9(NC) IC30.E10(NC) IC30.E12(NC) IC30.E13(NC) IC30.E14(NC) IC30.F1(NC) IC30.F2(NC) IC30.F3(NC) IC30.F10(NC) IC30.F12(NC) IC30.F13(NC) IC30.F14(NC) IC30.G1(NC) IC30.G2(NC) IC30.G3(NC) IC30.G10(NC) IC30.G12(NC) IC30.G13(NC) IC30.G14(NC) IC30.H1(NC) IC30.H2(NC) IC30.H3(NC) IC30.H5(NC) IC30.H12(NC) IC30.H13(NC) IC30.H14(NC) IC30.J1(NC) IC30.J2(NC) IC30.J3(NC) IC30.J5(NC) IC30.J12(NC) IC30.J13(NC) IC30.J14(NC) IC30.K1(NC) IC30.K2(NC) IC30.K3(NC) IC30.K6(NC) IC30.K7(NC) IC30.K10(NC) IC30.K12(NC) IC30.K13(NC) IC30.K14(NC) IC30.L1(NC) IC30.L2(NC) IC30.L3(NC) IC30.L12(NC) IC30.L13(NC) IC30.L14(NC) IC30.M1(NC) IC30.M2(NC) IC30.M3(NC) IC30.M7(NC) IC30.M8(NC) IC30.M9(NC) IC30.M10(NC) IC30.M11(NC) IC30.M12(NC) IC30.M13(NC) IC30.M14(NC) IC30.N1(NC) IC30.N3(NC) IC30.N6(NC) IC30.N7(NC) IC30.N8(NC) IC30.N9(NC) IC30.N10(NC) IC30.N11(NC) IC30.N12(NC) IC30.N13(NC) IC30.N14(NC) IC30.P1(NC) IC30.P2(NC) IC30.P7(NC) IC30.P8(NC) IC30.P9(NC) IC30.P10(NC) IC30.P11(NC) IC30.P12(NC) IC30.P13(NC) IC30.P14(NC) J1.6(NC) J1.17(EMU2) J1.18(EMU3) J1.19(EMU4) U1.A4(C:XDMA_EVENT_INTR0) U1.A5(B:OSC1_OUT) U1.A6(B:OSC1_IN) U1.B5(B:OSC1_GND) U1.D5(F:CAP_VDD_RTC) U1.D12(F:NC) U1.H6(F:VPP) U1.J6(F:NC) U1.K4(F:NC) U1.K13(B:USB0_CE) U1.L13(B:USB1_CE) U1.N6(A:PMIC_TS) U1.N7(A:PMIC_BAT_SENSE) U1.N13(B:PMIC_MUX_IN) U2.5(EECLK) U2.13(~PWRON2) U2.17(~PWRON3) U2.21(~PWRON4) U2.32(SUSPND) U4.3(ID) U4.5(N.C.) U5.4(NC_2) U5.5(NC) U6.3(ID) U6.5(N.C.) U8.3(ID) U8.5(N.C.) U9.3(ID) U9.5(N.C.) U10.5(N.C.) U11.9(QH_2) U19.13(NC_2) U19.16(NC) U$2.9(DNC) U$2.10(SPI_MODE) U$2.18(ENCB_DCEN_CFG4) U$2.19(ENCA_DCIN_CFG5) U$3.7(NC) U$7.23(ACLK) U$7.24(AP0) U$7.25(AP1) U$7.26(AP2) U$7.27(OSC_IN/AP3) U$7.28(AP4) U$9.9(DNC) U$9.10(SPI_MODE) U$9.18(ENCB_DCEN_CFG4) U$9.19(ENCA_DCIN_CFG5) U$10.5(EN) U$13.9(DNC) U$13.10(SPI_MODE) U$13.18(ENCB_DCEN_CFG4) U$13.19(ENCA_DCIN_CFG5) U$14.9(DNC) U$14.10(SPI_MODE) U$14.18(ENCB_DCEN_CFG4) U$14.19(ENCA_DCIN_CFG5) U$15.9(DNC) U$15.10(SPI_MODE) U$15.18(ENCB_DCEN_CFG4) U$15.19(ENCA_DCIN_CFG5) U$16.9(DNC) U$16.10(SPI_MODE) U$16.18(ENCB_DCEN_CFG4) U$16.19(ENCA_DCIN_CFG5) U$19.1 U$19.3 U$20.1 U$20.3 U$21.1 U$21.3 X24.14(RESERVED)

## Buses
LCD_D[0..15],LCD_VSYNC,LCD_HSYNC,LCD_DE,LCD_PCLK
MMC1_DAT[0..7],MMC1_CLK,MMC1_CMD
MII1_TXCLK,MII1_TXD[0..3],MII1_TXEN,MII1_CRS_DV,MII1_COL,MII1_RXCLK,MII1_RXD[0..3],MII1_RXERR,MII1_RXDV,MDIO_CLK,MDIO_DATA

## Notes on the sheet
- HDMI | USB
- LAN
- To test with 25MHz clock from SIP, populate this with 0R
- Configuration
- McASP is disabled.
- PHY_ADDR0
- PHY_ADDR1
- PHY_ADDR2
- MODE[0]
- MODE[1]
- MODE[2]
- MODE[3]
- IO_VOLT_SEL
- STP X/Y
- Analog etc
- End stops 2
- End stops 1
- Thermistors
- SIP LCD + LAN | eMMC
- STP Z/E | FANS+End stops
- MOSFET HBP
- MOSFET E | MOSFET H | MOSFET A
- Fan drivers
- Power | PWM etc
- STP H/A
- Power in
- 5V step down converter
- POWER
- Ext driver B
- RESET
- Ext driver C

## Power pins joined to a net without a drawn wire
VIN_BAT: U1.P8(A:VIN_BAT) U1.R8(A:VIN_BAT) U1.T8(A:VIN_BAT)

## Library data of the parts
C1 C2 C4-C6 C8 C10 C12 C13 C15 C16 C18-C21 C23 C24 C27-C31 C35 C38 C40 C44 C53 C54 C56 C60 C61 C63 C64 C66 C67 C69 C70 C72-C74 C82-C85 C87 C99 C107 C108 C110 C114 C115 C133 C134 C138 C140-C142 C150 C151 C155 = rcl:C-EU: CAPACITOR, European symbol; MPN: CL10B104KB8NNND; PARTNO: GRM155R71H104KE14J
C3 C7 C9 C11 C39 C88 C132 = rcl:C-EU: CAPACITOR, European symbol; MPN: C1005X7R1E223K050BB
C14 C17 C48 C80 = rcl:C-EU: CAPACITOR, European symbol; MPN: CL31B106KAHNNNE
C22 C57-C59 C102 = rcl:C-EU: CAPACITOR, European symbol; MPN: CL05B472KA5NNNC
C25 = rcl:CPOL-EU: POLARIZED CAPACITOR, European symbol; MPN: RSL0J101MCN1GB
C26 C33 C37 C45 C46 C55 C65 C68 C86 C103 = rcl:C-EU: CAPACITOR, European symbol; MPN: GRM155R60J475ME47D
C32 = rcl:C-EU: CAPACITOR, European symbol; MPN: CL10B104KB8NNND; PARTNO: GRM155R71H104KE14J; VID: 490-6351-2-ND
C34 C109 C111-C113 = rcl:C-EU: CAPACITOR, European symbol; MPN: GRM155R61A225KE95D
C36 C146-C149 C156 C157 = rcl:C-EU: CAPACITOR, European symbol; MPN: GRM0335C1E180JA01D; PARTNO: GRM1555C1H180JA01D
C41 C47 C89 C91-C93 C100 = rcl:C-EU: CAPACITOR, European symbol; MPN: GMK325BJ106MN-T
C42 C94 C95 C97 C98 C101 = Panasonic-EEEFK_EEEFP:C; MPN: RHS1V101MCN1GS
C135 C143 = rcl:C-EU: CAPACITOR, European symbol; MPN: C0805C106K8PACTU
C136 = rcl:C-EU: CAPACITOR, European symbol; MPN: CL05B471KB5NNNC
D1-D5 = diode:MBRA340T3: Surface Mount Schottky Power Rectifier Source: http://www.onsemi.com/pub_link/Collateral/MBRA340T3-D.PDF; MPN: MBRA340T3G
EEPROM_WP PMIC_NRESET SYS_5V SYS_RTC_1V8 SYS_VDD1_3V3 SYS_VDD2_3V3 SYS_VDD3_3V3 VDD_CODE VDD_MPU VDDS_DDR VDDS_PLL = testpad:TP: Test pad
IC1 IC6 IC7 = 74xx-little-de:74*1G126: Single Bus Buffer Gate With 3-State Outputs; MPN: M74VHC1GT126DF1G
IC29 = Revolve:LAN8710A: LAN8710A edit this description Auto generated by make-symbol-device-package-bsdl.ulp Rev. 44 Source: LAN8710A.txt; MPN: LAN8710A-EZC-TR
IC30 = Revolve:MTFC2GMDEA: MTFC2GMDEA edit this description Auto generated by make-symbol-device-package-bsdl.ulp Rev. 44 Source: MTFC2GMDEA.txt; MPN: MTFC2GMDEA-0M WT
J1 = OSD3358-SM-RED Platform:CTI-JTAG
J2 J3 = Seeed-Connector:GROVE-CONNECTOR-DIP(4P-2.0): 320110033; MPN: 1125S-4P
JP1 JP2 = SparkFun:FIDUCIAL: Fiducial Alignment Points Various fiducial points for machine vision alignment.
L1 = SparkFun:RT8040T330; MPN: NRS8040T150MJGJ
L2 L3 = rcl:L-US: INDUCTOR, American symbol; MPN: MU2029-151Y
LED0 LED1-LED13 = led:LED: LED OSRAM: - CHIPLED LG R971, LG N971, LY N971, LG Q971, LY Q971, LO R971, LY R971 LH N974, LH R974 LS Q976, LO Q976, LY Q976 LO Q996 - Hyper CHIPLED LW Q18S LB Q993, LB Q99A, LB R99A - SideLED LS A670, LO A670, LY A670, LG A670, LP A670 LB A673, LV A673, LT A673, LW A673 LH A674 LY A675 LS A676, LA A676, LO A676, LY A676, LW A676 LS A679, LY A679, LG A679 - Hyper Micro SIDELED® LS Y876, LA Y876, LO Y876, LY Y876 LT Y87S - SmartLED LW L88C, LW L88S LB L89C, LB L89S, LG L890 LS L89K, LO L89K, LY L89K LS L896, LA L896, LO L896, LY L896 - TOPLED LS T670, LO T670, LY T670, LG T670, LP T670 LSG T670, LSP T670, LSY T670, LOP T670, LYG T670 LG T671, LOG T671, LSG T671 LB T673, LV T673, LT T673, LW T673 LH T674 LS T676, LA T676, LO T676, LY T676, LB T676, LH T676, LSB T676, LW T676 LB T67C, LV T67C, LT T67C, LS T67K, LO T67K, LY T67K, LW E67C LS E67B, LA E67B, LO E67B, LY E67B, LB E67C, LV E67C, LT E67C LW T67C LS T679, LY T679, LG T679 LS T770, LO T770, LY T770, LG T770, LP T770 LB T773, LV T773, LT T773, LW T773 LH T774 LS E675, LA E675, LY E675, LS T675 LS T776, LA T776, LO T776, LY T776, LB T776 LHGB T686 LT T68C, LB T68C - Hyper Mini TOPLED® LB M676 - Mini TOPLED Santana® LG M470 LS M47K, LO M47K, LY M47K Source: http://www.osram.convergy.de LUXEON: - LUMILED® LXK2-PW12-R00, LXK2-PW12-S00, LXK2-PW14-U00, LXK2-PW14-V00 LXK2-PM12-R00, LXK2-PM12-S00, LXK2-PM14-U00 LXK2-PE12-Q00, LXK2-PE12-R00, LXK2-PE12-S00, LXK2-PE14-T00, LXK2-PE14-U00 LXK2-PB12-K00, LXK2-PB12-L00, LXK2-PB12-M00, LXK2-PB14-N00, LXK2-PB14-P00, LXK2-PB14-Q00 LXK2-PR12-L00, LXK2-PR12-M00, LXK2-PR14-Q00, LXK2-PR14-R00 LXK2-PD12-Q00, LXK2-PD12-R00, LXK2-PD12-S00 LXK2-PH12-R00, LXK2-PH12-S00 LXK2-PL12-P00, LXK2-PL12-Q00, LXK2-PL12-R00 Source: www.luxeon.com KINGBRIGHT: KA-3528ASYC Source: www.kingbright.com; MPN: 19-217/BHC-ZL1M2RY/3T; SPN: 19-217/BHC-ZL1M2RY/3T-ND
LOGO1 = ohw-logo:OSHW_LOGO_FILL
MGT1-MGT4 = OSD3358-SM-RED Platform:MOUNTING_HOLE: Chassis Mounting Hole w/GND connection ability
Q1-Q3 Q8 = transistor-power:AON6758; MPN: SIRA34DP-T1-GE3
Q4-Q7 Q12 = semicon-smd-ipc:NPN-TRANSISTOR_: NPN TRANSISTOR; MPN: AO7400; SPN: 785-1084-1-ND
Q9 = OSD3358-SM-RED Platform:MMBT2907*: PNP Transistror; MPN: MMBT2907ALT3G
Q10 Q11 Q13 Q14 = Manga_screen_rev_B:DMC2038LVT; MPN: DMC2038LVT-7; SPN: DMC2038LVT-7DICT-ND
R1 R2 R6 R27 R31 R35 R37-R40 R43 R50 R55-R58 R60 R73 R78 R81 R87 R88 R90 R94 R113 R121 R127-R137 R140 R141 R152 = rcl:R-EU_: RESISTOR, European symbol; MPN: RC0402FR-0710KL
R3 R4 R7-R11 R29 R30 R42 R138 R139 R149 = rcl:R-EU_: RESISTOR, European symbol; MPN: RL1220S-R10-F
R5 R13-R21 R23-R25 R28 R32-R34 R36 R44 R46-R48 R51 R54 R61-R69 R74-R77 R89 R91-R93 R112 R142-R145 R171-R173 = rcl:R-EU_: RESISTOR, European symbol; MPN: RC0402FR-074K7L
R12 R45 R105 R107 R108 R114-R120 R174-R179 = rcl:R-EU_: RESISTOR, European symbol; MPN: RC0402FR-07100KL; SPN: 311-100KLRCT-ND
R22 = rcl:R-EU_: RESISTOR, European symbol; MPN: RC0402FR-0713K3L; SPN: YAG2974CT-ND
R26 = resistor:R-EU_: RESISTOR, European symbol; MPN: ERJ-MP2MF1M0U; SPN: P19339TR-ND
R41 R86 = rcl:R-EU_: RESISTOR, European symbol; MPN: RC0402FR-0740K2L
R49 = rcl:R-EU_: RESISTOR, European symbol; MPN: RC0402FR-07499RL; SPN: 311-499LRCT-ND
R52 R59 R70-R72 R126 = rcl:R-EU_: RESISTOR, European symbol; MPN: RC0402FR-072R2L
R53 = rcl:R-EU_: RESISTOR, European symbol; MPN: RC0402FR-071KL; SPN: 311-100KLRCT-ND
R79 R80 = rcl:R-EU_: RESISTOR, European symbol; MPN: RC0402JR-07470RL
R82 = rcl:R-EU_: RESISTOR, European symbol; MPN: RC0402FR-0712K1L
R83 = rcl:R-EU_: RESISTOR, European symbol; MPN: RC0402FR-0710RL
R84 = rcl:R-EU_: RESISTOR, European symbol; MPN: RC0402FR-07100KL
R85 R95-R104 R161 R162 R180 R181 = rcl:R-EU_: RESISTOR, European symbol; MPN: RC0402FR-07100RL
R106 R109-R111 R153-R155 = rcl:R-EU_: RESISTOR, European symbol; MPN: RC0402FR-071KL
R122-R125 = rcl:R-EU_: RESISTOR, European symbol; MPN: RC0402FR-0749R9L
R146 = rcl:R-EU_: RESISTOR, European symbol; MPN: NCP15WB473E03RC
R147 R148 R151 R156-R160 = rcl:R-EU_: RESISTOR, European symbol; MPN: RC0402FR-0722RL
R150 = rcl:R-EU_: RESISTOR, European symbol; MPN: RC0402JR-071ML
R163-R170 = rcl:R-EU_: RESISTOR, European symbol; MPN: RC0402FR-0715KL
SV1 SV5 = con-lstb:MA04-1: PIN HEADER; OC_FARNELL: unknown; OC_NEWARK: unknown
SV2 SV3 = con-lstb:MA04-2: PIN HEADER; OC_FARNELL: unknown; OC_NEWARK: unknown
U1 = Octavo-Systems:OSD3358-512M-BSM: Octavo Systems LLC OSD335x Family SiP: 21mm x 21mm, 1.27mm pitch 256 pin BGA contains AM3358, 512MB DDR3, TPS65217, TL5209, EEPROM and passives. Commerical Temperature: 0C to 85C.; MPN: OSD3358-512M-BSM
U2 = Texas Instruments_By_element14_Batch_1:TUSB2046BIRHBT: 4-PORT HUB FOR THE UNIVERSAL SERIAL BUS WITH OPTIONAL SERIAL EEPROM INTERFACE; MPN: TUSB2046BIRHBT; OC_FARNELL: 1610201; OC_NEWARK: 14N8499; PACKAGE: QFN-32; SUPPLIER: Texas Instruments
U3 = Texas Instruments_By_element14_Batch_1:TPS2061D: CURRENT-LIMITED, POWER-DISTRIBUTION SWITCHES; MPN: TPS2061D; OC_FARNELL: 1755536; OC_NEWARK: 65J6887; PACKAGE: SOIC-8; SUPPLIER: Texas Instruments
U4 U6 U8-U10 = OSD3358-SM-RED Platform:TPD4S012_DRY_6; MPN: TPD4S012DRYR
U5 = Texas Instruments_By_element14_Batch_1:UA78L05ACD: POSITIVE-VOLTAGE REGULATORS; MPN: UA78L12ACDR; OC_FARNELL: 9593845; OC_NEWARK: 09F1481; PACKAGE: SOIC-8; SPN: 296-15054-6-ND; SUPPLIER: Texas Instruments
U7 = OSD3358-SM-RED Platform:TLVH431; MPN: TLVH431IDBZR
U11 = Replicape_B3:SN74AHC595PW: 8 bit shift registers with 3-state output registers; MPN: SN74AHC595PW; OC_FARNELL: 1741463; OC_NEWARK: 50R5930; PACKAGE: TSSOP-16; SUPPLIER: Texas Instruments
U12 = OSD3358-SM-RED Platform:APX811: Diodes APX811/812 4-pin Microprocessor Supervisor with Manual Reset. Datasheet <https://www.diodes.com/assets/Datasheets/APX811_812.pdf> Footprint <https://www.diodes.com/assets/Package-Files/SOT143.pdf> Digikey <http://www.digikey.com/products/en?keywords=APX811-29UG-7DICT-ND> Footprint compatible devices: STM811 <http://www.st.com/content/st_com/en/products/reset-and-supervisor-ics/resets-and-voltage-detectors/stm811.html> Digikey <http://www.digikey.com/product-detail/en/stmicroelectronics/STM811SW16F/497-3348-1-ND> STM6315 <http://www.st.com/content/st_com/en/products/reset-and-supervisor-ics/resets-and-voltage-detectors/stm6315.html> Digikey <http://www.digikey.com/product-detail/en/stmicroelectronics/STM6315SDW13F/497-4975-1-ND> ADM811; MPN: APX811-46UG-7
U13 = Texas Instruments_By_element14_Batch_1:INA199A1DCKR: CURRENT SHUNT MONITOR; MPN: INA199A1DCKR; OC_FARNELL: -; OC_NEWARK: 74R6382; PACKAGE: SC70-6; SUPPLIER: Texas Instruments
U19 = TI-CD4050BD:CD4050BD: CMOS Hex Buffer/Converters; MPN: CD4050BDR; OC_FARNELL: 1740857; OC_NEWARK: 50R5062; PACKAGE: 16-SOIC; SUPPLIER: Texas Instruments
U$2 U$9 U$13-U$16 = TMC2130-Eval_v13:TRINAMIC_TMC2130_QFN36; MPN: TMC2130-LA-T
U$3 = Revolve:LPJ0011BBNL; MPN: LPJ0011BBNL
U$4 = Replicape_B3:CC-BY-SA
U$5 U$6 = Revolve:USB-A; MPN: 320010475; SPN: SEEED
U$7 = Revolve:TDA19988BHN/C1,557; MPN: TDA19988BHN/C1,518; SPN: 568-12059-ND
U$8 = Manga_screen_rev_B-3:USB-MICRO; MPN: ST-USB-001G-4
U$10 = Texas Instruments_By_element14_Batch_1:TPS54202; MPN: TPS54202DDCR
U$11 U$17 = Revolve:SISS27DN; MPN: SISS27DN-T1-GE3; SPN: SISS27DN-T1-GE3CT-ND
U$18 = Revolve:TPD12S016-RKT; MPN: TPD12S016PWR; SPN: 296-29690-1-ND
U$19-U$21 = Manga_custom:TACT_SWITCH
X1 X7 X8 X10 X11 X13 X19 X22 X29 = con-molex:22-?-03: CONNECTOR wire to board 2.54 mm (.1 inch) pitch header; MPN: 640455-3; OC_FARNELL: unknown; OC_NEWARK: unknown
X2 X20 = con-phoenix-508:MSTBA4: PHOENIX; MF: FARNELL; MPN: 39532-1004; OC_FARNELL: 3705195; OC_NEWARK: 71C4163
X3 X21 X26 = con-phoenix-508:MSTBA2: PHOENIX; MF: FARNELL; MPN: 39532-1002; OC_FARNELL: 3705171; OC_NEWARK: 71C4161
X4-X6 X9 = con-molex:22-?-02: CONNECTOR wire to board 2.54 mm (.1 inch) pitch header; MPN: 640455-2; OC_FARNELL: 9731601; OC_NEWARK: unknown
X12 X14-X18 X25 = con-molex:22-?-04: CONNECTOR wire to board 2.54 mm (.1 inch) pitch header; MPN: 640455-4; OC_FARNELL: unknown; OC_NEWARK: unknown
X24 = hdmi:HDMI; MPN: 609-4614-2-ND; PARTNO: 10029449-111RLF
Y1 Y2 = Revolve:445C33D24M00000; MPN: 445C33D25M00000; SPN: CTX1434TR-ND
Y4 = Revolve:445C33D24M00000; MPN: NX8045GB-6MHZ-STD-CSF-3

## Net classes
0 default: width 0.127 mm, drill 0.254 mm
1 power: width 0.25 mm